# EAGLE schematic lisa_l (EAGLE 6.1)

## Sheet 1 of 6
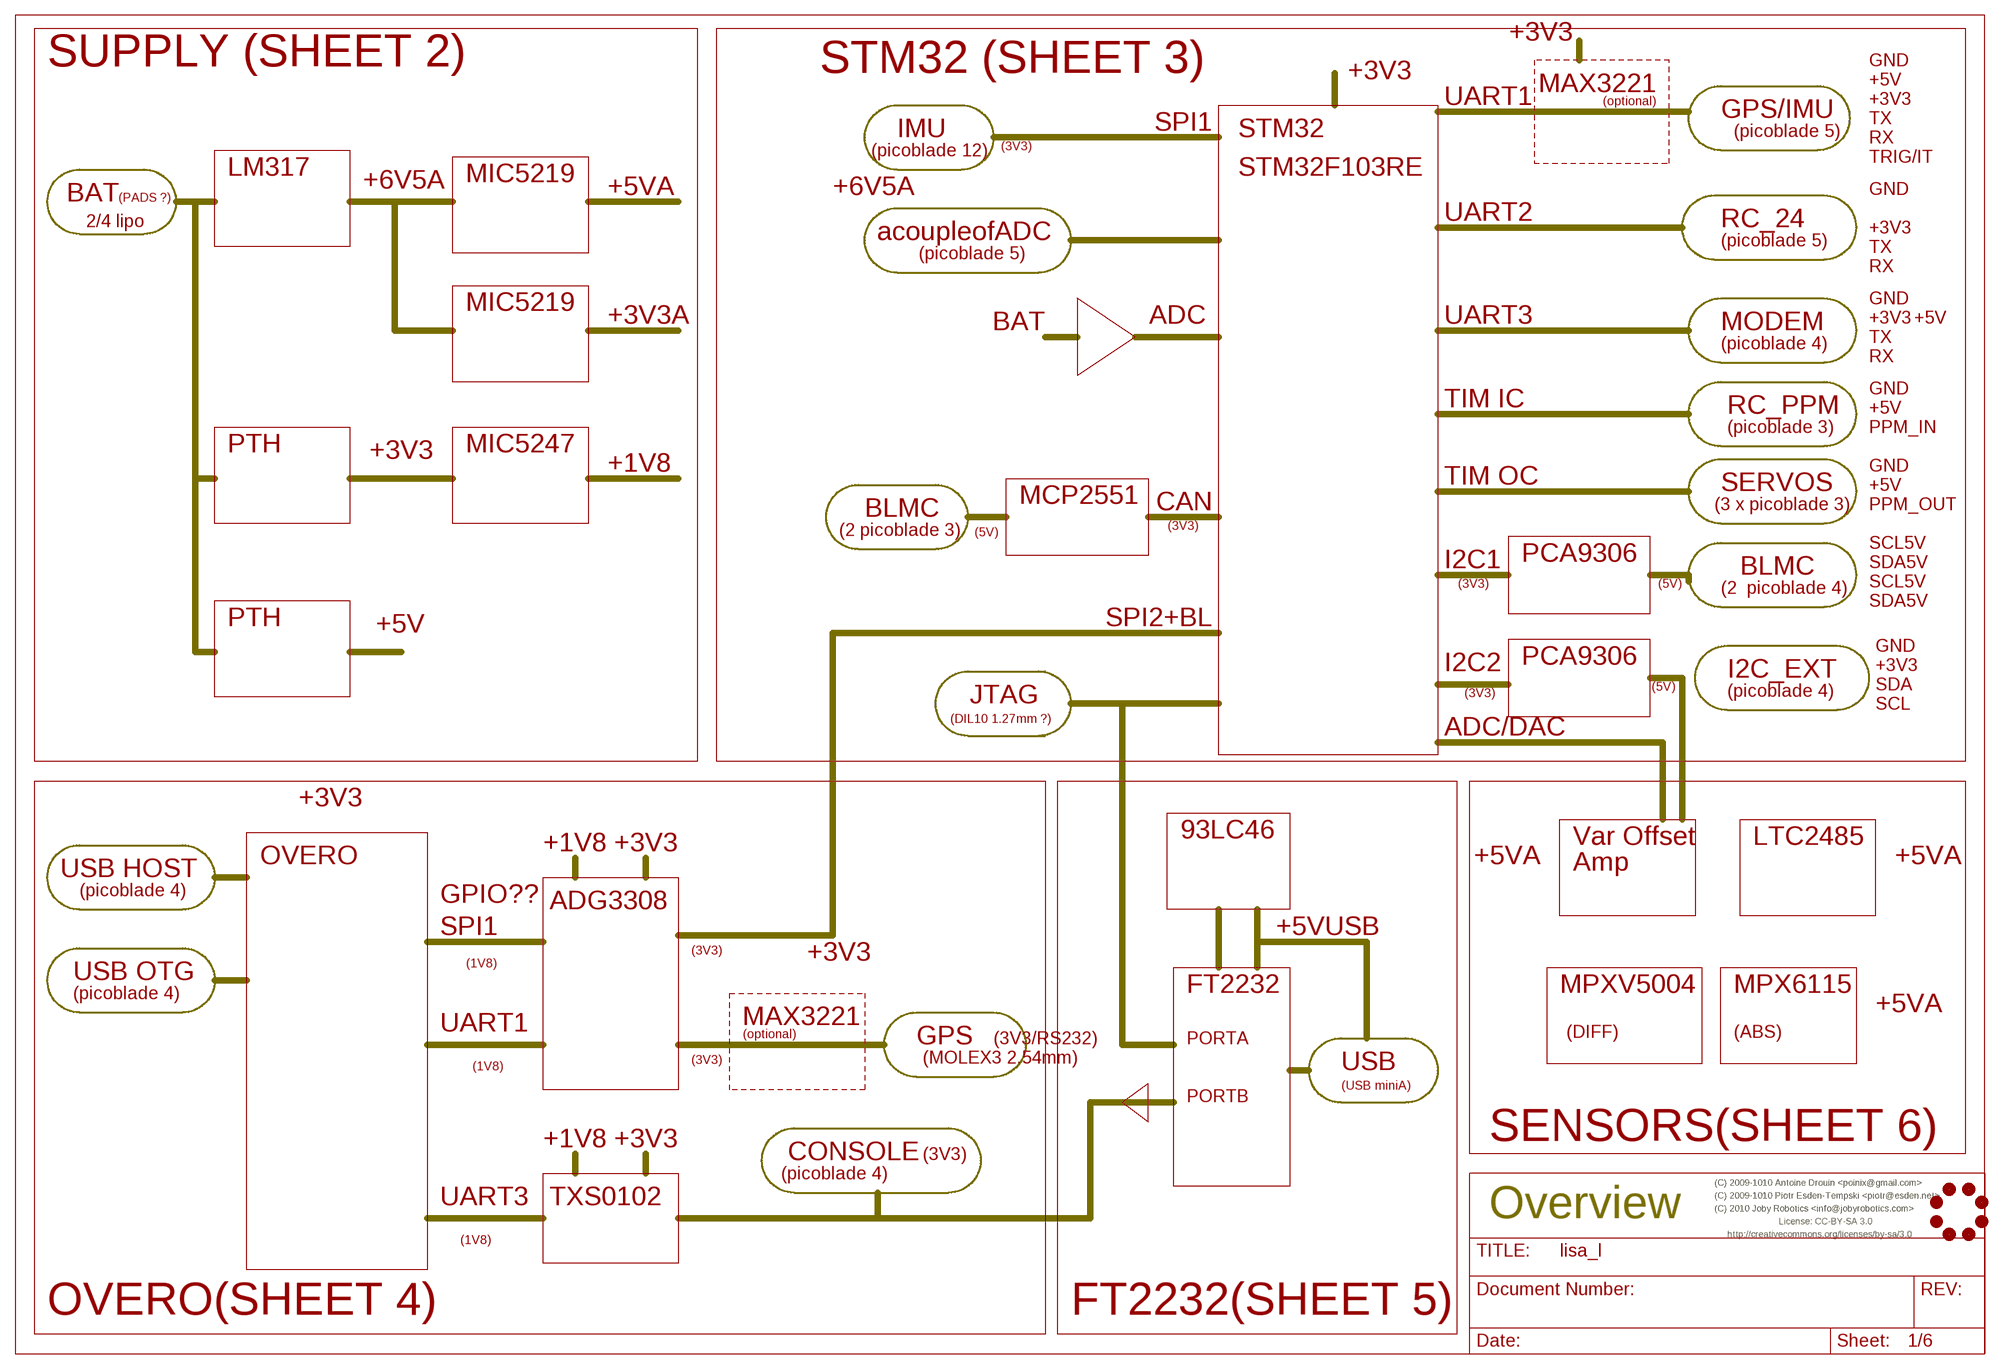
[diagram p0: schematic, sheet 1]

### Parts
JL1  JOBY_LOGO-12MIL  [JOBY_LOGO_12MIL]

### Notes on the sheet
- +3V3
- SUPPLY (SHEET 2) | STM32 (SHEET 3) | GND
- +3V3
- +5V
- MAX3221
- UART1 | (optional) | +3V3
- GPS/IMU
- TX
- IMU | SPI1 | STM32
- (picoblade 5)
- RX
- (3V3)
- (picoblade 12)
- TRIG/IT
- LM317 | MIC5219 | STM32F103RE
- +6V5A | +5VA | +6V5A
- GND
- BAT | (PADS ?)
- UART2
- 2/4 lipo | RC_24
- +3V3
- acoupleofADC
- (picoblade 5)
- TX
- (picoblade 5)
- RX
- GND
- MIC5219
- +3V3A | BAT | ADC | UART3 | MODEM | +3V3 | +5V
- TX
- (picoblade 4)
- RX
- GND
- TIM IC | RC_PPM
- +5V
- (picoblade 3) | PPM_IN
- PTH | +3V3 | MIC5247
- +1V8 | GND
- TIM OC | SERVOS
- +5V
- MCP2551 | CAN
- (3 x picoblade 3) | PPM_OUT
- BLMC
- (3V3)
- (2 picoblade 3) | (5V)
- SCL5V
- I2C1 | PCA9306
- SDA5V
- BLMC
- (3V3) | (5V) | SCL5V
- (2  picoblade 4)
- SDA5V
- PTH | +5V | SPI2+BL
- GND
- I2C2 | PCA9306
- +3V3
- I2C_EXT
- (5V) | SDA
- (3V3) | (picoblade 4)
- JTAG
- SCL
- (DIL10 1.27mm ?)
- ADC/DAC
- +3V3
- 93LC46 | Var Offset | LTC2485
- +1V8 | +3V3
- OVERO | +5VA | Amp | +5VA
- USB HOST
- (picoblade 4)
- GPIO?? | ADG3308
- SPI1 | +5VUSB
- (3V3)
- +3V3
- (1V8)
- USB OTG
- FT2232 | MPXV5004 | MPX6115
- (picoblade 4)
- +5VA
- UART1 | MAX3221
- (optional) | (DIFF) | (ABS)
- GPS | (3V3/RS232) | PORTA
- (3V3) | (MOLEX3 2.54mm)
- (1V8) | USB
- (USB miniA)
- PORTB
- +1V8 | +3V3 | SENSORS(SHEET 6)
- CONSOLE | (3V3)
- (picoblade 4)
- (C) 2009-1010 Antoine Drouin <poinix@gmail.com>
- (C) 2009-1010 Piotr Esden-Tempski <piotr@esden.net>
- UART3 | TXS0102
- (C) 2010 Joby Robotics <info@jobyrobotics.com>
- Overview
- License: CC-BY-SA 3.0
- http://creativecommons.org/licenses/by-sa/3.0
- (1V8)
- OVERO(SHEET 4) | FT2232(SHEET 5)

## Sheet 2 of 6
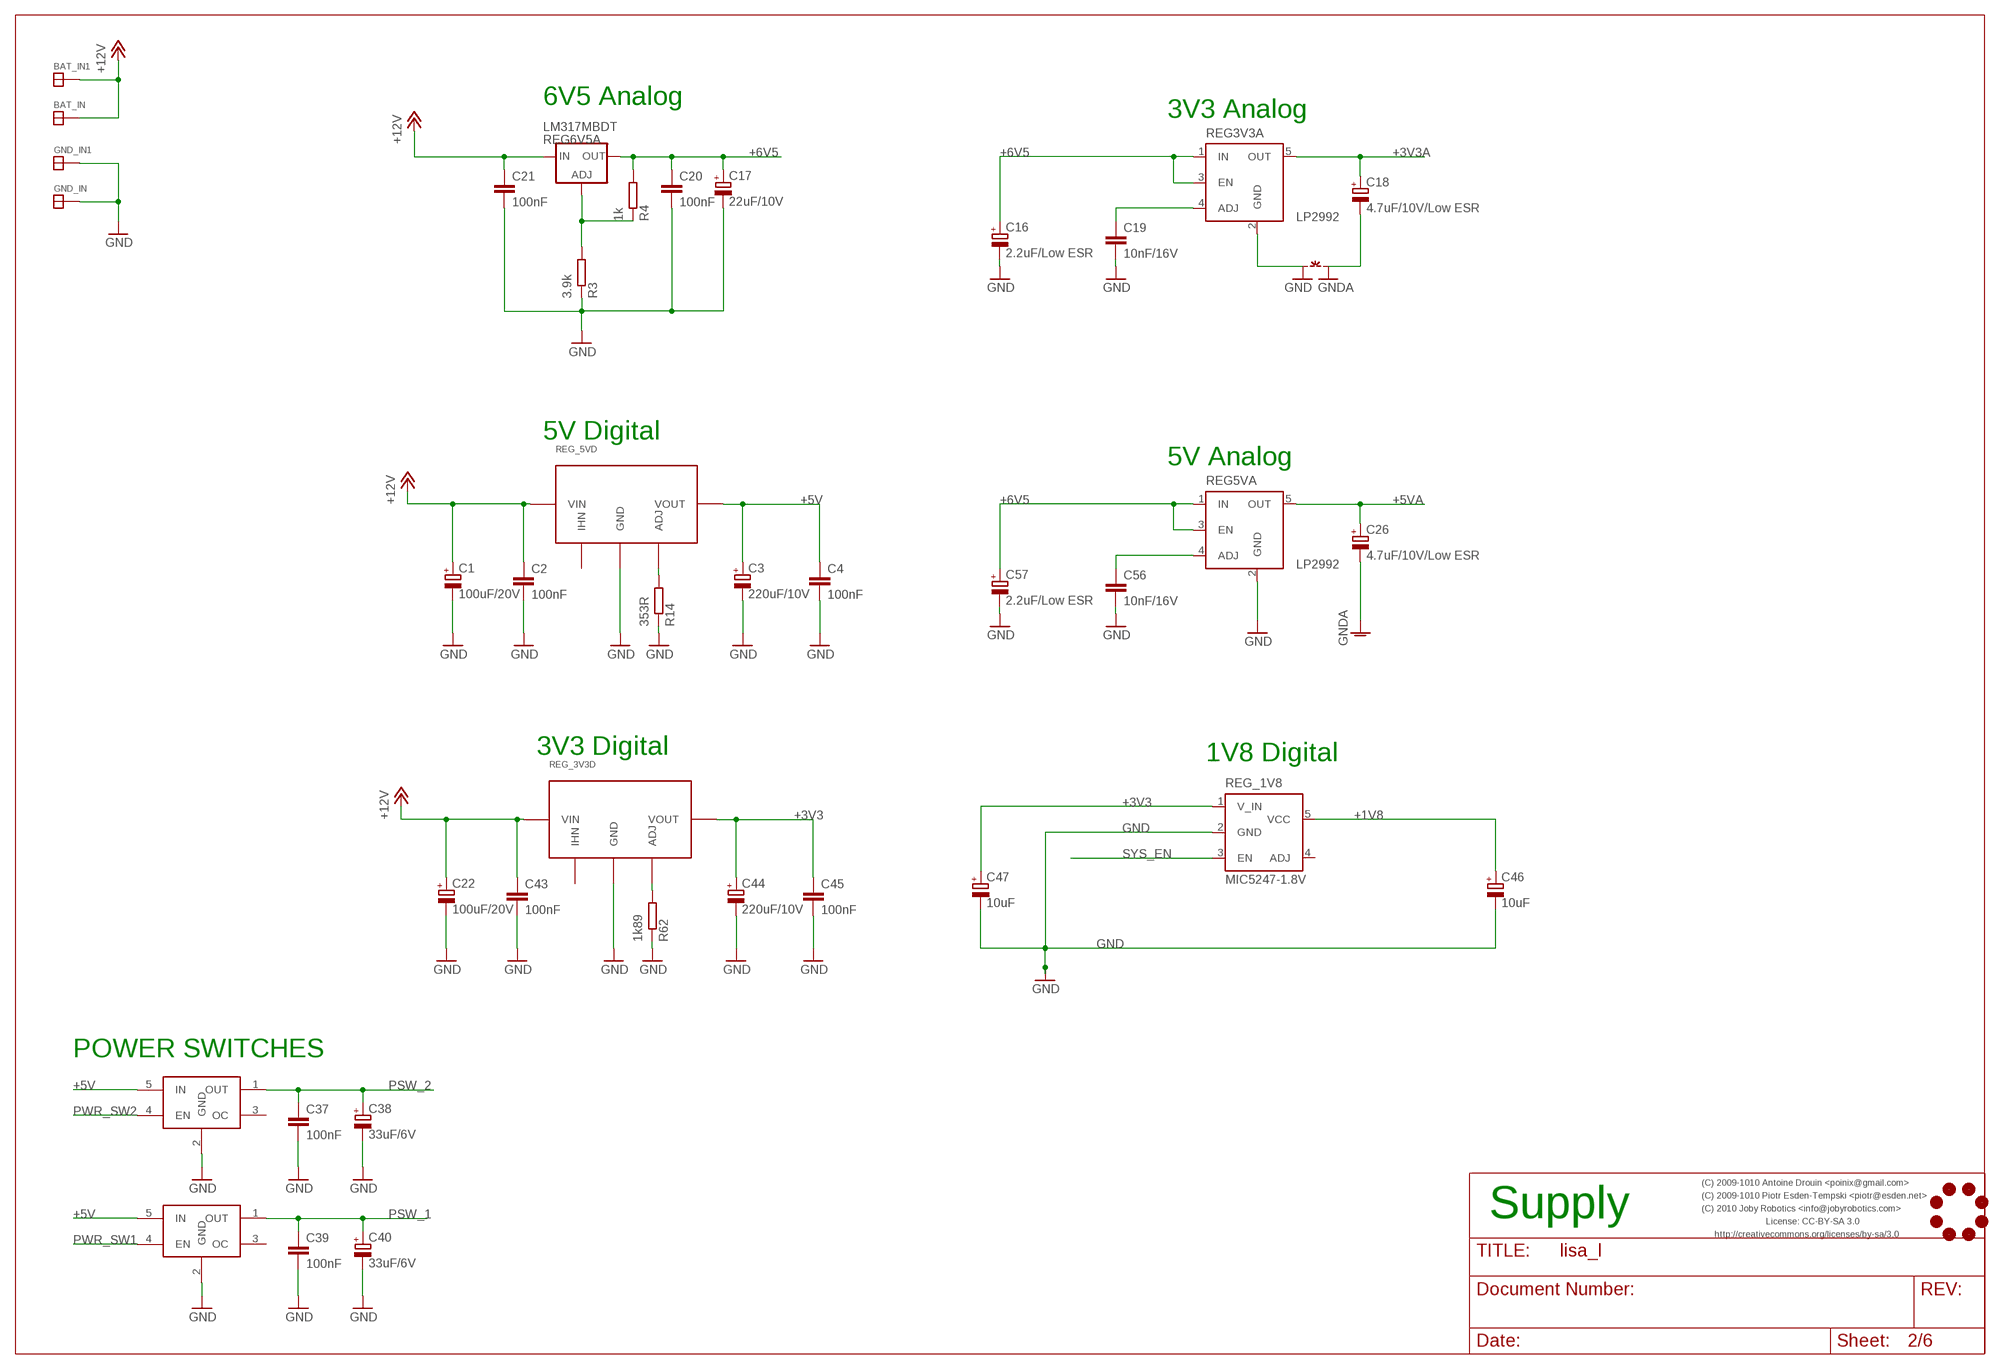
[diagram p1: schematic, sheet 2]

### Parts
BAT_IN  SOLDER_PAD150_75  [SOLD_PAD_150_75]
BAT_IN1  SOLDER_PAD150_75  [SOLD_PAD_150_75]
C1  100uF/20V  CAPACITOR-POLD  [7343/D]
C2  100nF  CAPACITOR-0603  [0603-CAP]
C3  220uF/10V  CAPACITOR-POLD  [7343/D]
C4  100nF  CAPACITOR-0603  [0603-CAP]
C16  2.2uF/Low ESR  CAPACITOR-POL-0603  [0603-POL-CAP]
C17  22uF/10V  CAPACITOR-POL-1206  [1206-POL-CAP]
C18  4.7uF/10V/Low ESR  CAPACITOR-POL-0603  [0603-POL-CAP]
C19  10nF/16V  CAPACITOR-0603  [0603-CAP]
C20  100nF  CAPACITOR-0603  [0603-CAP]
C21  100nF  CAPACITOR-0603  [0603-CAP]
C22  100uF/20V  CAPACITOR-POLD  [7343/D]
C26  4.7uF/10V/Low ESR  CAPACITOR-POL-0603  [0603-POL-CAP]
C37  100nF  CAPACITOR-0603  [0603-CAP]
C38  33uF/6V  CAPACITOR-POL-1206  [1206-POL-CAP]
C39  100nF  CAPACITOR-0603  [0603-CAP]
C40  33uF/6V  CAPACITOR-POL-1206  [1206-POL-CAP]
C43  100nF  CAPACITOR-0603  [0603-CAP]
C44  220uF/10V  CAPACITOR-POLD  [7343/D]
C45  100nF  CAPACITOR-0603  [0603-CAP]
C46  10uF  CAPACITOR-POL-0603  [0603-POL-CAP]
C47  10uF  CAPACITOR-POL-0603  [0603-POL-CAP]
C56  10nF/16V  CAPACITOR-0603  [0603-CAP]
C57  2.2uF/Low ESR  CAPACITOR-POL-0603  [0603-POL-CAP]
GND_IN  SOLDER_PAD150_75  [SOLD_PAD_150_75]
GND_IN1  SOLDER_PAD150_75  [SOLD_PAD_150_75]
JL2  JOBY_LOGO-12MIL  [JOBY_LOGO_12MIL]
PWS1  TPS2051B  [SOT23-5L]
PWS2  TPS2051B  [SOT23-5L]
R3  3.9k  RESISTOR-0603  [0603-RES]
R4  1k  RESISTOR-0603  [0603-RES]
R14  353R  RESISTOR-0603  [0603-RES]
R62  1k89  RESISTOR-0603  [0603-RES]
REG3V3A  LP2992  MIC5219BM5  [SOT23-5]
REG5VA  LP2992  MIC5219BM5  [SOT23-5]
REG6V5A  LM317MBDT  [DPACK]
REG_1V8  MIC5247-1.8V  MIC5219YM5  [SOT-23-5]
REG_3V3D  PTHTH  [PTH_TH]
REG_5VD  PTHTH  [PTH_TH]
~NUDEV~1  GND-GNDA  [GND-GNDA]

### Nets
+1V8 [supply]: C46.+ REG_1V8.5(VCC) ; also sheet 4
+3V3: C44.+ C45.P$1 C47.+ REG_1V8.1(V_IN) REG_3V3D.P$3(VOUT) ; also sheet 3,4
+3V3A: C18.+ REG3V3A.5(OUT) ; also sheet 6
+5V: C3.+ C4.P$1 PWS1.5(IN) PWS2.5(IN) REG_5VD.P$3(VOUT) ; also sheet 3,4
+5VA: C26.+ REG5VA.5(OUT) ; also sheet 6
+6V5: C16.+ C17.+ C20.P$1 C57.+ R4.P$2 REG3V3A.1(IN) REG3V3A.3(EN) REG5VA.1(IN) REG5VA.3(EN) REG6V5A.4(OUT) ; also sheet 3,4
+12V: BAT_IN1.P$1 BAT_IN.P$1 C1.+ C2.P$1 C21.P$1 C22.+ C43.P$1 REG6V5A.3(IN) REG_3V3D.P$1(VIN) REG_5VD.P$1(VIN) ; also sheet 3
GND: C1.- C2.P$2 C3.- C4.P$2 C16.- C17.- C19.P$2 C20.P$2 C21.P$2 C22.- C37.P$2 C38.- C39.P$2 C40.- C43.P$2 C44.- C45.P$2 C46.- C47.- C56.P$2 C57.- GND_IN1.P$1 GND_IN.P$1 PWS1.2(GND) PWS2.2(GND) R3.P$1 R14.P$1 R62.P$1 REG3V3A.2(GND) REG5VA.2(GND) REG_1V8.2(GND) REG_3V3D.P$2(GND) REG_5VD.P$2(GND) ~NUDEV~1.GND ; also sheet 3,4,5
GNDA: C18.- C26.- ~NUDEV~1.GNDA ; also sheet 6
N$3: R62.P$2 REG_3V3D.P$4(ADJ)
N$10: C56.P$1 REG5VA.4(ADJ)
N$23: C19.P$1 REG3V3A.4(ADJ)
N$33: R3.P$2 R4.P$1 REG6V5A.1(ADJ)
PSW_1: C39.P$1 C40.+ PWS1.1(OUT) ; also sheet 3
PSW_2: C37.P$1 C38.+ PWS2.1(OUT) ; also sheet 3
PWR_SW1: PWS1.4(EN) ; also sheet 3
PWR_SW2: PWS2.4(EN) ; also sheet 3
RIPRIP: R14.P$2 REG_5VD.P$4(ADJ)
SYS_EN: REG_1V8.3(EN) ; also sheet 4
Unconnected: PWS1.3(OC) PWS2.3(OC) REG_1V8.4(ADJ) REG_3V3D.P$5(IHN) REG_5VD.P$5(IHN)

### Notes on the sheet
- 6V5 Analog
- 3V3 Analog
- 5V Digital
- 5V Analog
- 3V3 Digital | 1V8 Digital
- POWER SWITCHES
- (C) 2009-1010 Antoine Drouin <poinix@gmail.com>
- (C) 2009-1010 Piotr Esden-Tempski <piotr@esden.net>
- (C) 2010 Joby Robotics <info@jobyrobotics.com>
- Supply
- License: CC-BY-SA 3.0
- http://creativecommons.org/licenses/by-sa/3.0

## Sheet 3 of 6
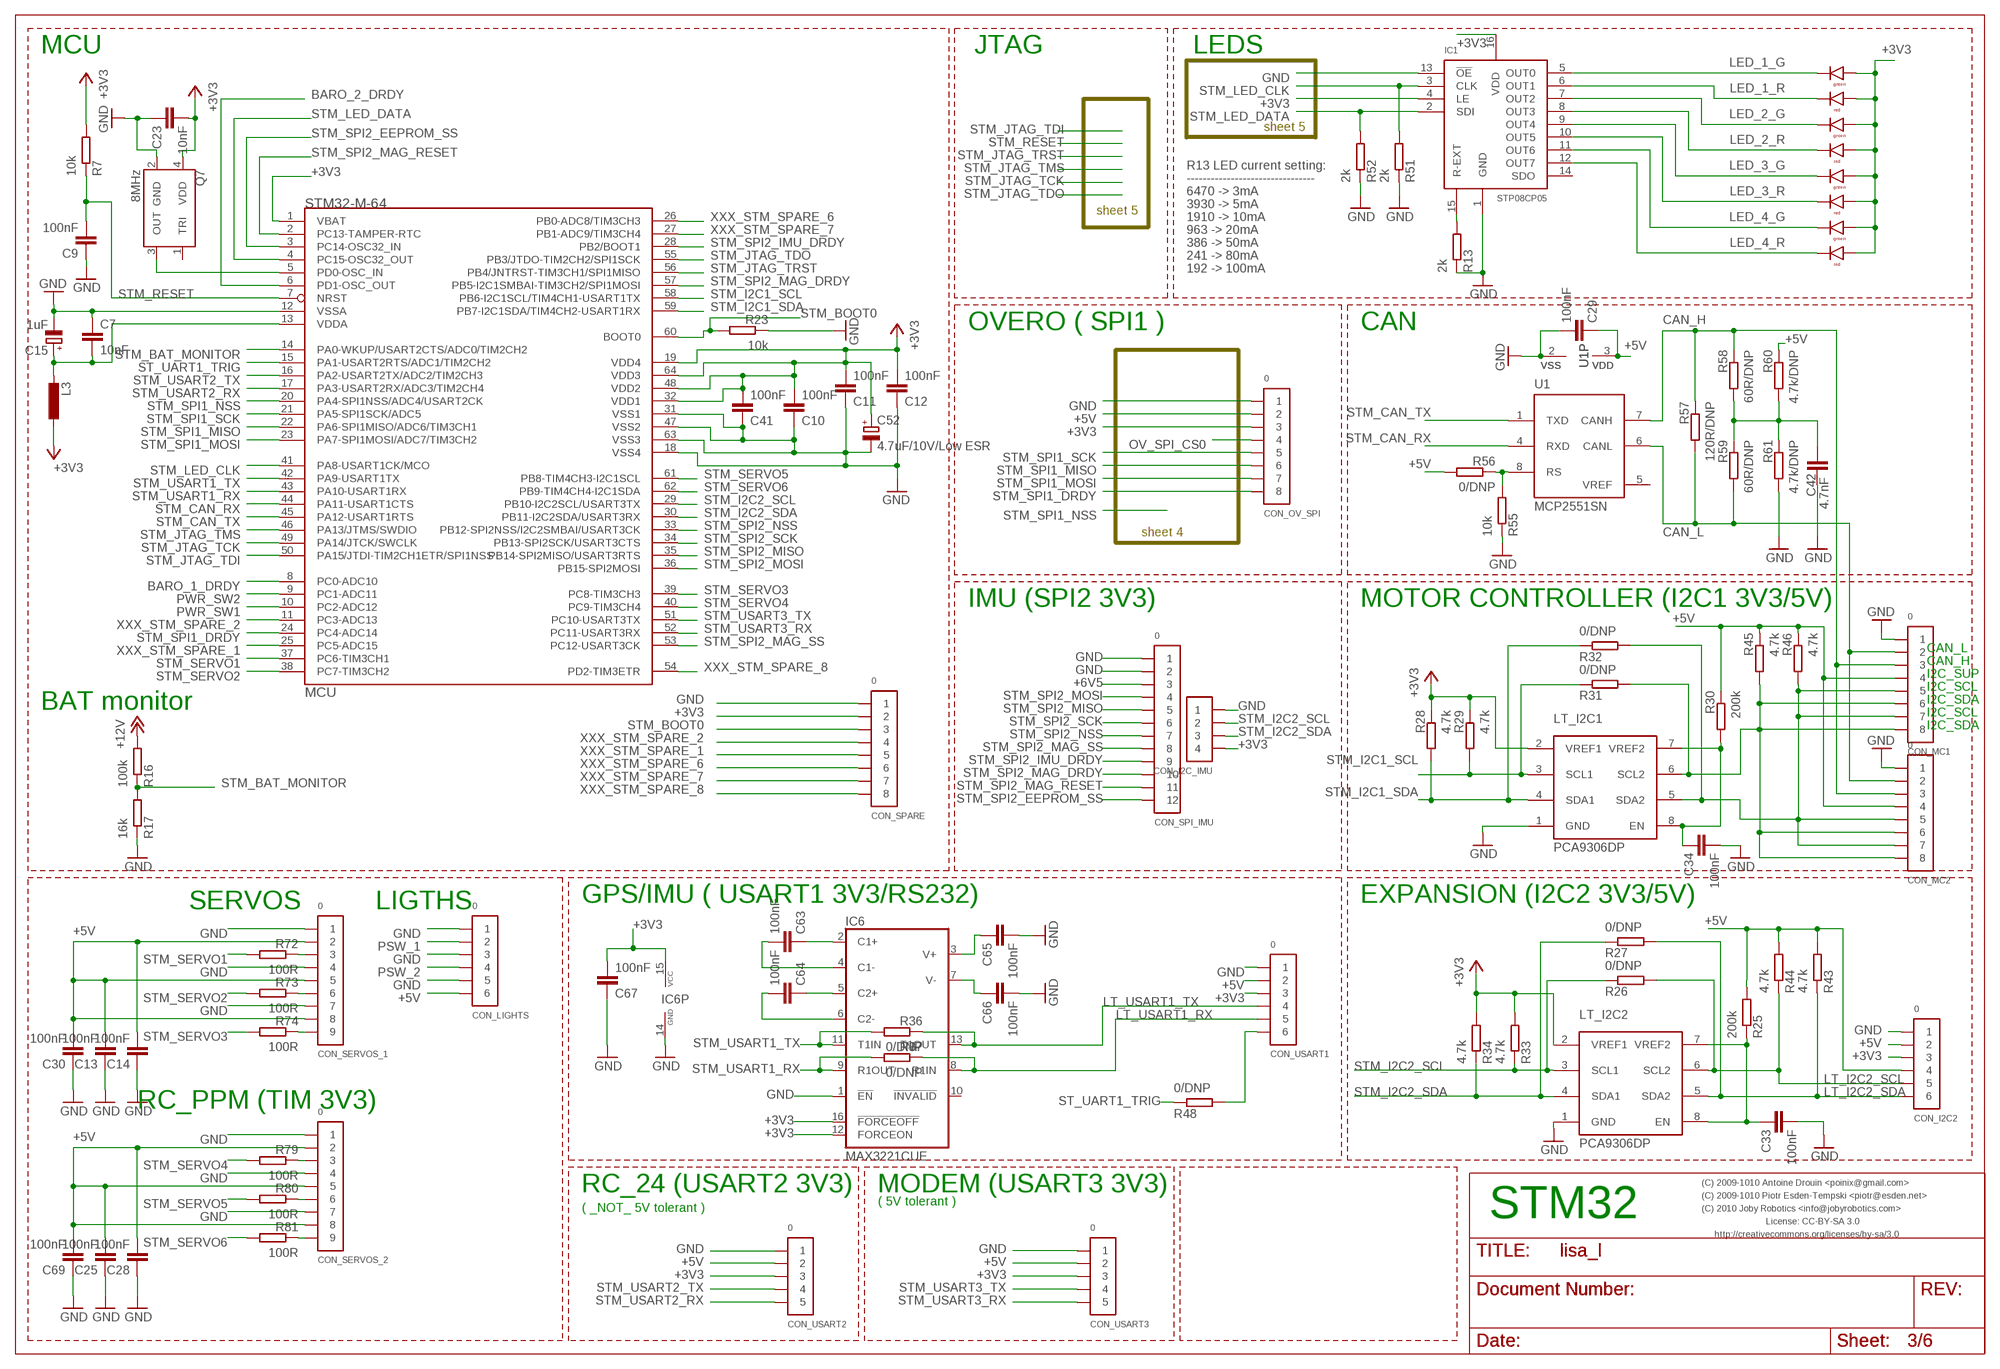
[diagram p2: schematic, sheet 3]

### Parts
C7  10nF  CAPACITOR-0603  [0603-CAP]
C9  100nF  CAPACITOR-0603  [0603-CAP]
C10  100nF  CAPACITOR-0603  [0603-CAP]
C11  100nF  CAPACITOR-0603  [0603-CAP]
C12  100nF  CAPACITOR-0603  [0603-CAP]
C13  100nF  CAPACITOR-0603  [0603-CAP]
C14  100nF  CAPACITOR-0603  [0603-CAP]
C15  1uF  CAPACITOR-POL-0603  [0603-POL-CAP]
C23  10nF  CAPACITOR-0603  [0603-CAP]
C25  100nF  CAPACITOR-0603  [0603-CAP]
C28  100nF  CAPACITOR-0603  [0603-CAP]
C29  100nF  CAPACITOR-0603  [0603-CAP]
C30  100nF  CAPACITOR-0603  [0603-CAP]
C33  100nF  CAPACITOR-0603  [0603-CAP]
C34  100nF  CAPACITOR-0603  [0603-CAP]
C41  100nF  CAPACITOR-0603  [0603-CAP]
C42  4.7nF  CAPACITOR-0603  [0603-CAP]
C52  4.7uF/10V/Low ESR  CAPACITOR-POL-0603  [0603-POL-CAP]
C63  100nF  CAPACITOR-0603  [0603-CAP]
C64  100nF  CAPACITOR-0603  [0603-CAP]
C65  100nF  CAPACITOR-0603  [0603-CAP]
C66  100nF  CAPACITOR-0603  [0603-CAP]
C67  100nF  CAPACITOR-0603  [0603-CAP]
C69  100nF  CAPACITOR-0603  [0603-CAP]
CON_I2C2  0  CONN_6-1-53261  [PB-53261-06]
CON_I2C_IMU  CONN_4-1-53398  [PB-53398-04]
CON_LIGHTS  0  CONN_6-1-53261  [PB-53261-06]
CON_MC1  0  CONN_8-1-53261  [PB-53261-08]
CON_MC2  0  CONN_8-1-53261  [PB-53261-08]
CON_OV_SPI  0  CONN_8-1-53398  [PB-53398-08]
CON_SERVOS_1  0  CONN_9-1-53261  [PB-53261-09]
CON_SERVOS_2  0  CONN_9-1-53261  [PB-53261-09]
CON_SPARE  0  CONN_8-1-53261  [PB-53261-08]
CON_SPI_IMU  0  CONN_12-1-53398  [PB-53398-12]
CON_USART1  0  CONN_6-1-53398  [PB-53398-06]
CON_USART2  0  CONN_5-1-53261  [PB-53261-05]
CON_USART3  0  CONN_5-1-53261  [PB-53261-05]
IC1  STP08CP05  [TSSOP16]
IC6  MAX3221CUE  [TSSOP16]
L3  INDUCTOR-0603  [0603-IND]
LED_1  LED_DUO  [DUO_LED]
LED_2  LED_DUO  [DUO_LED]
LED_3  LED_DUO  [DUO_LED]
LED_4  LED_DUO  [DUO_LED]
LT_I2C1  PCA9306DP  [TSSOP_B3]
LT_I2C2  PCA9306DP  [TSSOP_B3]
MCU  STM32-M-64  [LQFP64]
Q7  8MHz  ASE_ASCILLATOR  [ASE_OSCILLATOR]
R7  10k  RESISTOR-0603  [0603-RES]
R13  2k  RESISTOR-0603  [0603-RES]
R16  100k  RESISTOR-0603  [0603-RES]
R17  16k  RESISTOR-0603  [0603-RES]
R23  10k  RESISTOR-0603  [0603-RES]
R25  200k  RESISTOR-0603  [0603-RES]
R26  0/DNP  RESISTOR-0603  [0603-RES]
R27  0/DNP  RESISTOR-0603  [0603-RES]
R28  4.7k  RESISTOR-0603  [0603-RES]
R29  4.7k  RESISTOR-0603  [0603-RES]
R30  200k  RESISTOR-0603  [0603-RES]
R31  0/DNP  RESISTOR-0603  [0603-RES]
R32  0/DNP  RESISTOR-0603  [0603-RES]
R33  4.7k  RESISTOR-0603  [0603-RES]
R34  4.7k  RESISTOR-0603  [0603-RES]
R36  0/DNP  RESISTOR-0603  [0603-RES]
R37  0/DNP  RESISTOR-0603  [0603-RES]
R43  4.7k  RESISTOR-0603  [0603-RES]
R44  4.7k  RESISTOR-0603  [0603-RES]
R45  4.7k  RESISTOR-0603  [0603-RES]
R46  4.7k  RESISTOR-0603  [0603-RES]
R48  0/DNP  RESISTOR-0603  [0603-RES]
R51  2k  RESISTOR-0603  [0603-RES]
R52  2k  RESISTOR-0603  [0603-RES]
R55  10k  RESISTOR-0603  [0603-RES]
R56  0/DNP  RESISTOR-0603  [0603-RES]
R57  120R/DNP  RESISTOR-0603  [0603-RES]
R58  60R/DNP  RESISTOR-0603  [0603-RES]
R59  60R/DNP  RESISTOR-0603  [0603-RES]
R60  4.7k/DNP  RESISTOR-0603  [0603-RES]
R61  4.7k/DNP  RESISTOR-0603  [0603-RES]
R72  100R  RESISTOR-0603  [0603-RES]
R73  100R  RESISTOR-0603  [0603-RES]
R74  100R  RESISTOR-0603  [0603-RES]
R79  100R  RESISTOR-0603  [0603-RES]
R80  100R  RESISTOR-0603  [0603-RES]
R81  100R  RESISTOR-0603  [0603-RES]
U1  MCP2551SN  [SO-08]

### Nets
+3V3: C10.P$2 C11.P$2 C12.P$2 C23.P$2 C41.P$2 C52.+ C67.P$2 CON_I2C2.3 CON_I2C_IMU.4 CON_OV_SPI.3 CON_SPARE.2 CON_USART1.3 CON_USART2.3 CON_USART3.3 IC1.4(LE) IC1.16(VDD) IC6.12(FORCEON) IC6.15(VCC) IC6.16(!FORCEOFF) L3.P$1 LED_1.1 LED_1.4 LED_2.1 LED_2.4 LED_3.1 LED_3.4 LED_4.1 LED_4.4 LT_I2C1.2(VREF1) LT_I2C2.2(VREF1) MCU.1(VBAT) MCU.19(VDD4) MCU.32(VDD1) MCU.48(VDD2) MCU.64(VDD3) Q7.4(VDD) R7.P$2 R28.P$1 R29.P$1 R33.P$2 R34.P$2 ; also sheet 2,4
+5V: C13.P$2 C14.P$2 C25.P$2 C28.P$2 C29.P$1 C30.P$2 C69.P$2 CON_I2C2.2 CON_I2C2.4 CON_LIGHTS.6 CON_MC1.4 CON_MC2.4 CON_OV_SPI.2 CON_SERVOS_1.2 CON_SERVOS_1.5 CON_SERVOS_1.8 CON_SERVOS_2.2 CON_SERVOS_2.5 CON_SERVOS_2.8 CON_USART1.2 CON_USART2.2 CON_USART3.2 R25.P$2 R30.P$1 R43.P$2 R44.P$2 R45.P$1 R46.P$1 R56.P$2 R60.P$1 U1.3(VDD) ; also sheet 2,4
+6V5: CON_SPI_IMU.3 ; also sheet 2,4
+12V: R16.P$2 ; also sheet 2
BARO_1_DRDY: MCU.8(PC0-ADC10) ; also sheet 6
BARO_2_DRDY: MCU.6(PD1-OSC_OUT) ; also sheet 6
CAN_H: CON_MC1.3 CON_MC2.3 R57.P$1 R58.P$1 U1.7(CANH)
CAN_L: CON_MC1.2 CON_MC2.2 R57.P$2 R59.P$2 U1.6(CANL)
GND: C7.P$1 C9.P$1 C10.P$1 C11.P$1 C12.P$1 C13.P$1 C14.P$1 C15.- C23.P$1 C25.P$1 C28.P$1 C29.P$2 C30.P$1 C33.P$2 C34.P$2 C41.P$1 C42.P$1 C52.- C65.P$2 C66.P$2 C67.P$1 C69.P$1 CON_I2C2.1 CON_I2C_IMU.1 CON_LIGHTS.1 CON_LIGHTS.3 CON_LIGHTS.5 CON_MC1.1 CON_MC2.1 CON_OV_SPI.1 CON_SERVOS_1.1 CON_SERVOS_1.4 CON_SERVOS_1.7 CON_SERVOS_2.1 CON_SERVOS_2.4 CON_SERVOS_2.7 CON_SPARE.1 CON_SPI_IMU.1 CON_SPI_IMU.2 CON_USART1.1 CON_USART2.1 CON_USART3.1 IC1.1(GND) IC1.13(!OE) IC6.1(!EN) IC6.14(GND) LT_I2C1.1(GND) LT_I2C2.1(GND) MCU.12(VSSA) MCU.18(VSS4) MCU.31(VSS1) MCU.47(VSS2) MCU.63(VSS3) Q7.2(GND) R13.P$1 R17.P$1 R23.P$1 R51.P$1 R52.P$1 R55.P$1 R61.P$2 U1.2(VSS) ; also sheet 2,4,5
INT/TRIGGER: CON_USART1.6 R48.P$2
LED_1_G: IC1.5(OUT0) LED_1.3
LED_1_R: IC1.6(OUT1) LED_1.2
LED_2_G: IC1.7(OUT2) LED_2.3
LED_2_R: IC1.8(OUT3) LED_2.2
LED_3_G: IC1.9(OUT4) LED_3.3
LED_3_R: IC1.10(OUT5) LED_3.2
LED_4_G: IC1.11(OUT6) LED_4.3
LED_4_R: IC1.12(OUT7) LED_4.2
LT_I2C2_SCL: CON_I2C2.5 LT_I2C2.6(SCL2) R26.P$2 R44.P$1
LT_I2C2_SDA: CON_I2C2.6 LT_I2C2.5(SDA2) R27.P$2 R43.P$1
LT_USART1_RX: CON_USART1.5 IC6.8(R1IN) R37.P$1
LT_USART1_TX: CON_USART1.4 IC6.13(T1OUT) R36.P$1
N$1: IC1.15(R-EXT) R13.P$2
N$2: MCU.5(PD0-OSC_IN) Q7.3(OUT)
N$11: C34.P$1 LT_I2C1.7(VREF2) LT_I2C1.8(EN) R30.P$2
N$17: CON_SERVOS_1.3 R72.P$1
N$19: R55.P$2 R56.P$1 U1.8(RS)
N$20: C33.P$1 LT_I2C2.7(VREF2) LT_I2C2.8(EN) R25.P$1
N$25: C42.P$2 R58.P$2 R59.P$1 R60.P$2 R61.P$1
N$37: CON_SERVOS_1.6 R73.P$1
N$38: CON_SERVOS_1.9 R74.P$1
N$57: CON_SERVOS_2.9 R81.P$1
N$58: CON_SERVOS_2.6 R80.P$1
N$59: CON_SERVOS_2.3 R79.P$1
N$127: C63.P$1 IC6.2(C1+)
N$130: C63.P$2 IC6.4(C1-)
N$131: C64.P$1 IC6.5(C2+)
N$132: C64.P$2 IC6.6(C2-)
N$133: C66.P$1 IC6.7(V-)
N$134: C65.P$1 IC6.3(V+)
OV_SPI_CS0: CON_OV_SPI.4 ; also sheet 4
PSW_1: CON_LIGHTS.2 ; also sheet 2
PSW_2: CON_LIGHTS.4 ; also sheet 2
PWR_SW1: MCU.10(PC2-ADC12) ; also sheet 2
PWR_SW2: MCU.9(PC1-ADC11) ; also sheet 2
SCL_0_TRANSLATED: CON_MC1.6 CON_MC1.8 CON_MC2.6 CON_MC2.8 LT_I2C1.6(SCL2) R31.P$2 R45.P$2
SDA_0_TRANSLATED: CON_MC1.5 CON_MC1.7 CON_MC2.5 CON_MC2.7 LT_I2C1.5(SDA2) R32.P$2 R46.P$2
ST_UART1_TRIG: MCU.15(PA1-USART2RTS/ADC1/TIM2CH2) R48.P$1
STM_BAT_MONITOR: MCU.14(PA0-WKUP/USART2CTS/ADC0/TIM2CH2) R16.P$1 R17.P$2
STM_BOOT0: CON_SPARE.3 MCU.60(BOOT0) R23.P$2
STM_CAN_RX: MCU.44(PA11-USART1CTS) U1.4(RXD)
STM_CAN_TX: MCU.45(PA12-USART1RTS) U1.1(TXD)
STM_I2C1_SCL: LT_I2C1.3(SCL1) MCU.58(PB6-I2C1SCL/TIM4CH1-USART1TX) R29.P$2 R31.P$1
STM_I2C1_SDA: LT_I2C1.4(SDA1) MCU.59(PB7-I2C1SDA/TIM4CH2-USART1RX) R28.P$2 R32.P$1
STM_I2C2_SCL: CON_I2C_IMU.2 LT_I2C2.3(SCL1) MCU.29(PB10-I2C2SCL/USART3TX) R26.P$1 R33.P$1 ; also sheet 6
STM_I2C2_SDA: CON_I2C_IMU.3 LT_I2C2.4(SDA1) MCU.30(PB11-I2C2SDA/USART3RX) R27.P$1 R34.P$1 ; also sheet 6
STM_JTAG_TCK: MCU.49(PA14/JTCK/SWCLK) ; also sheet 5
STM_JTAG_TDI: MCU.50(PA15/JTDI-TIM2CH1ETR/SPI1NSS) ; also sheet 5
STM_JTAG_TDO: MCU.55(PB3/JTDO-TIM2CH2/SPI1SCK) ; also sheet 5
STM_JTAG_TMS: MCU.46(PA13/JTMS/SWDIO) ; also sheet 5
STM_JTAG_TRST: MCU.56(PB4/JNTRST-TIM3CH1/SPI1MISO) ; also sheet 5
STM_LED_CLK: IC1.3(CLK) MCU.41(PA8-USART1CK/MCO) R51.P$2
STM_LED_DATA: IC1.2(SDI) MCU.4(PC15-OSC32_OUT) R52.P$2
STM_RESET: C9.P$2 MCU.7(NRST) R7.P$1 ; also sheet 5
STM_SERVO1: MCU.37(PC6-TIM3CH1) R72.P$2
STM_SERVO2: MCU.38(PC7-TIM3CH2) R73.P$2
STM_SERVO3: MCU.39(PC8-TIM3CH3) R74.P$2
STM_SERVO4: MCU.40(PC9-TIM3CH4) R79.P$2
STM_SERVO5: MCU.61(PB8-TIM4CH3-I2C1SCL) R80.P$2
STM_SERVO6: MCU.62(PB9-TIM4CH4-I2C1SDA) R81.P$2
STM_SPI1_DRDY: CON_OV_SPI.8 MCU.24(PC4-ADC14) ; also sheet 4
STM_SPI1_MISO: CON_OV_SPI.6 MCU.22(PA6-SPI1MISO/ADC6/TIM3CH1) ; also sheet 4
STM_SPI1_MOSI: CON_OV_SPI.7 MCU.23(PA7-SPI1MOSI/ADC7/TIM3CH2) ; also sheet 4
STM_SPI1_NSS: MCU.20(PA4-SPI1NSS/ADC4/USART2CK) ; also sheet 4
STM_SPI1_SCK: CON_OV_SPI.5 MCU.21(PA5-SPI1SCK/ADC5) ; also sheet 4
STM_SPI2_EEPROM_SS: CON_SPI_IMU.12 MCU.3(PC14-OSC32_IN)
STM_SPI2_IMU_DRDY: CON_SPI_IMU.9 MCU.28(PB2/BOOT1)
STM_SPI2_MAG_DRDY: CON_SPI_IMU.10 MCU.57(PB5-I2C1SMBAI-TIM3CH2/SPI1MOSI)
STM_SPI2_MAG_RESET: CON_SPI_IMU.11 MCU.2(PC13-TAMPER-RTC)
STM_SPI2_MAG_SS: CON_SPI_IMU.8 MCU.53(PC12-USART3CK)
STM_SPI2_MISO: CON_SPI_IMU.5 MCU.35(PB14-SPI2MISO/USART3RTS)
STM_SPI2_MOSI: CON_SPI_IMU.4 MCU.36(PB15-SPI2MOSI)
STM_SPI2_NSS: CON_SPI_IMU.7 MCU.33(PB12-SPI2NSS/I2C2SMBAI/USART3CK)
STM_SPI2_SCK: CON_SPI_IMU.6 MCU.34(PB13-SPI2SCK/USART3CTS)
STM_USART1_RX: IC6.9(R1OUT) MCU.43(PA10-USART1RX) R37.P$2
STM_USART1_TX: IC6.11(T1IN) MCU.42(PA9-USART1TX) R36.P$2
STM_USART2_RX: CON_USART2.5 MCU.17(PA3-USART2RX/ADC3/TIM2CH4)
STM_USART2_TX: CON_USART2.4 MCU.16(PA2-USART2TX/ADC2/TIM2CH3)
STM_USART3_RX: CON_USART3.5 MCU.52(PC11-USART3RX)
STM_USART3_TX: CON_USART3.4 MCU.51(PC10-USART3TX)
VDDA: C7.P$2 C15.+ L3.P$2 MCU.13(VDDA)
XXX_STM_SPARE_1: CON_SPARE.5 MCU.25(PC5-ADC15)
XXX_STM_SPARE_2: CON_SPARE.4 MCU.11(PC3-ADC13)
XXX_STM_SPARE_6: CON_SPARE.6 MCU.26(PB0-ADC8/TIM3CH3)
XXX_STM_SPARE_7: CON_SPARE.7 MCU.27(PB1-ADC9/TIM3CH4)
XXX_STM_SPARE_8: CON_SPARE.8 MCU.54(PD2-TIM3ETR)
Unconnected: IC1.14(SDO) IC6.10(!INVALID) Q7.1(TRI)

### Notes on the sheet
- MCU | JTAG | LEDS
- sheet 5
- R13 LED current setting:
- --------------------------------
- 6470 -> 3mA
- 3930 -> 5mA
- sheet 5
- 1910 -> 10mA
- 963 -> 20mA
- 386 -> 50mA
- 241 -> 80mA
- 192 -> 100mA
- OVERO ( SPI1 ) | CAN
- sheet 4
- IMU (SPI2 3V3) | MOTOR CONTROLLER (I2C1 3V3/5V)
- CAN_L
- CAN_H
- I2C_SUP
- I2C_SCL
- I2C_SDA
- BAT monitor
- I2C_SCL
- I2C_SDA
- SERVOS | LIGTHS | GPS/IMU ( USART1 3V3/RS232) | EXPANSION (I2C2 3V3/5V)
- RC_PPM (TIM 3V3)
- (C) 2009-1010 Antoine Drouin <poinix@gmail.com>
- RC_24 (USART2 3V3) | MODEM (USART3 3V3)
- (C) 2009-1010 Piotr Esden-Tempski <piotr@esden.net>
- ( 5V tolerant )
- ( _NOT_ 5V tolerant ) | (C) 2010 Joby Robotics <info@jobyrobotics.com>
- STM32
- License: CC-BY-SA 3.0
- http://creativecommons.org/licenses/by-sa/3.0

## Sheet 4 of 6
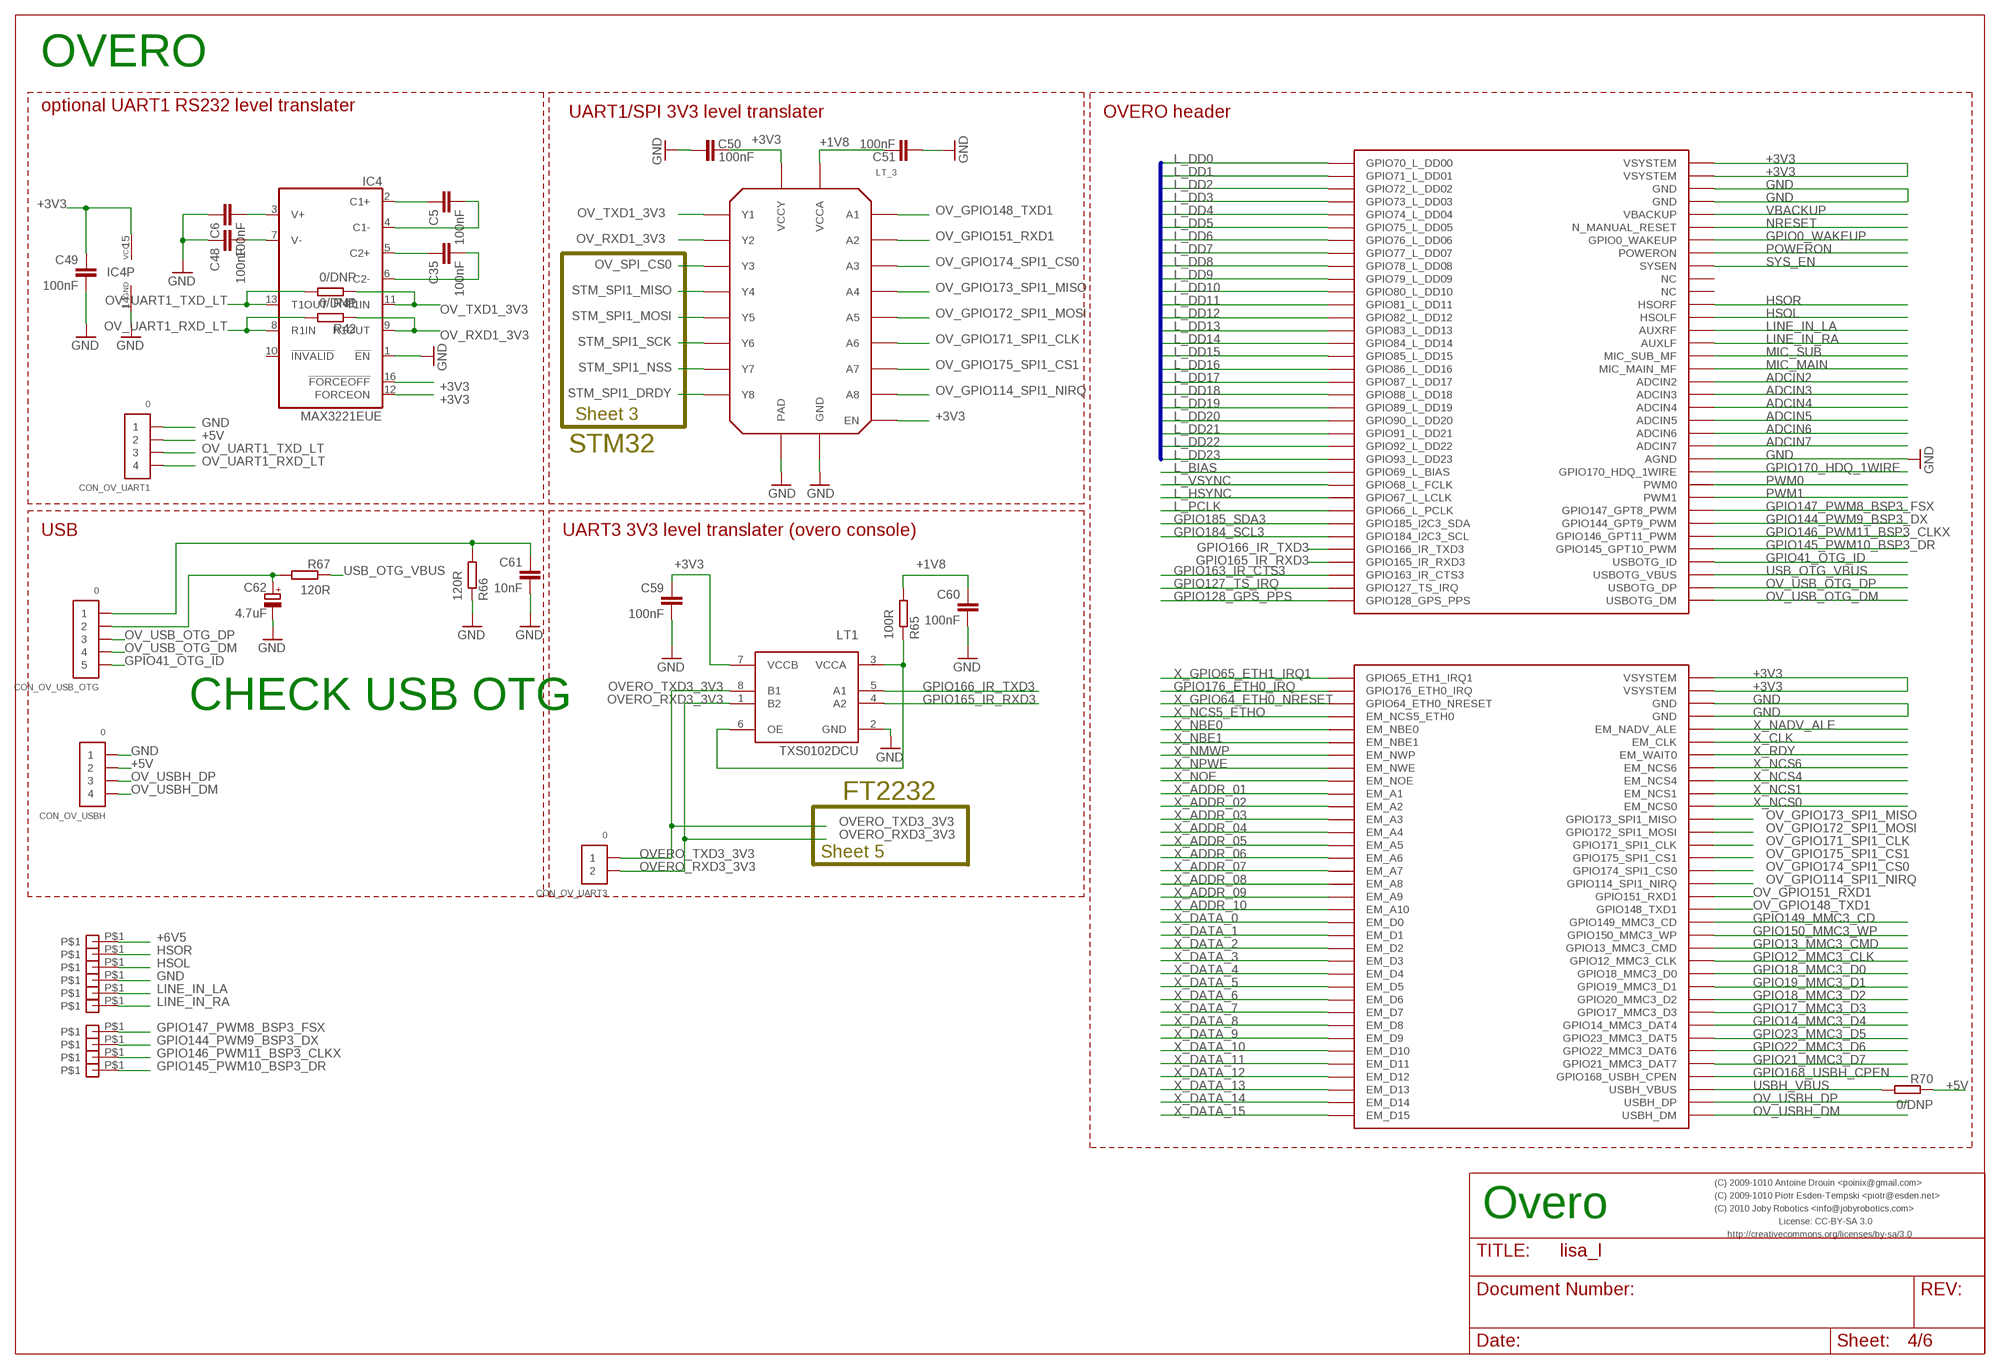
[diagram p3: schematic, sheet 4]

### Parts
C5  100nF  CAPACITOR-0603  [0603-CAP]
C6  100nF  CAPACITOR-0603  [0603-CAP]
C35  100nF  CAPACITOR-0603  [0603-CAP]
C48  100nF  CAPACITOR-0603  [0603-CAP]
C49  100nF  CAPACITOR-0603  [0603-CAP]
C50  100nF  CAPACITOR-0603  [0603-CAP]
C51  100nF  CAPACITOR-0603  [0603-CAP]
C59  100nF  CAPACITOR-0603  [0603-CAP]
C60  100nF  CAPACITOR-0603  [0603-CAP]
C61  10nF  CAPACITOR-0603  [0603-CAP]
C62  4.7uF  CAPACITOR-POL-0603  [0603-POL-CAP]
CON_OV_UART1  0  CONN_4-1-53261  [PB-53261-04]
CON_OV_UART3  0  CONN_2-1-53261  [PB-53261-02]
CON_OV_USB_OTG  0  CONN_5-1-53261  [PB-53261-05]
CON_OV_USBH  0  CONN_4-1-53261  [PB-53261-04]
IC4  MAX3221EUE  [TSSOP16]
J3&4  OVERO  [OVERO]
LT1  TXS0102DCU  [US8]
LT_3  AD3308BCPZ  [LFCSP-20]
R41  0/DNP  RESISTOR-0603  [0603-RES]
R42  0/DNP  RESISTOR-0603  [0603-RES]
R65  100R  RESISTOR-0603  [0603-RES]
R66  120R  RESISTOR-0603  [0603-RES]
R67  120R  RESISTOR-0603  [0603-RES]
R70  0/DNP  RESISTOR-0603  [0603-RES]
U$1  SOLDER_PAD  [SOLDER_PAD_SMALL]
U$2  SOLDER_PAD  [SOLDER_PAD_SMALL]
U$3  SOLDER_PAD  [SOLDER_PAD_SMALL]
U$4  SOLDER_PAD  [SOLDER_PAD_SMALL]
U$5  SOLDER_PAD  [SOLDER_PAD_SMALL]
U$6  SOLDER_PAD  [SOLDER_PAD_SMALL]
U$7  SOLDER_PAD  [SOLDER_PAD_SMALL]
U$8  SOLDER_PAD  [SOLDER_PAD_SMALL]
U$9  SOLDER_PAD  [SOLDER_PAD_SMALL]
U$10  SOLDER_PAD  [SOLDER_PAD_SMALL]

### Nets
+1V8 [supply]: C51.P$1 C60.P$1 LT_3.P$19(VCCA) R65.P$2 ; also sheet 2
+3V3: C49.P$1 C50.P$1 C59.P$1 IC4.12(FORCEON) IC4.15(VCC) IC4.16(!FORCEOFF) J3&4.VSYSTEM@1(VSYSTEM) J3&4.VSYSTEM@2(VSYSTEM) J3&4.VSYSTEM@66(VSYSTEM) J3&4.VSYSTEM@67(VSYSTEM) LT1.7(VCCB) LT_3.P$8(EN) LT_3.P$18(VCCY) ; also sheet 2,3
+5V: CON_OV_UART1.2 CON_OV_USBH.2 R70.P$1 ; also sheet 2,3
+6V5: U$1.P$1 ; also sheet 2,3
ADCIN2: J3&4.ADCIN2
ADCIN3: J3&4.ADCIN3
ADCIN4: J3&4.ADCIN4
ADCIN5: J3&4.ADCIN5
ADCIN6: J3&4.ADCIN6
ADCIN7: J3&4.ADCIN7
GND: C6.P$1 C48.P$1 C49.P$2 C50.P$2 C51.P$2 C59.P$2 C60.P$2 C61.P$2 C62.- CON_OV_UART1.1 CON_OV_USBH.1 IC4.1(!EN) IC4.14(GND) J3&4.AGND J3&4.GND J3&4.GND@33(GND) J3&4.GND@56(GND) J3&4.GND@70(GND) LT1.2(GND) LT_3.P$9(GND) LT_3.P$21(PAD) R66.P$1 U$4.P$1 ; also sheet 2,3,5
GPIO0_WAKEUP: J3&4.GPIO0_WAKEUP
GPIO12_MMC3_CLK: J3&4.GPIO12_MMC3_CLK
GPIO13_MMC3_CMD: J3&4.GPIO13_MMC3_CMD
GPIO14_MMC3_D4: J3&4.GPIO14_MMC3_DAT4
GPIO17_MMC3_D3: J3&4.GPIO17_MMC3_D3
GPIO18_MMC3_D0: J3&4.GPIO18_MMC3_D0
GPIO18_MMC3_D2: J3&4.GPIO20_MMC3_D2
GPIO19_MMC3_D1: J3&4.GPIO19_MMC3_D1
GPIO21_MMC3_D7: J3&4.GPIO21_MMC3_DAT7
GPIO22_MMC3_D6: J3&4.GPIO22_MMC3_DAT6
GPIO23_MMC3_D5: J3&4.GPIO23_MMC3_DAT5
GPIO41_OTG_ID: CON_OV_USB_OTG.5 J3&4.USBOTG_ID
GPIO127_TS_IRQ: J3&4.GPIO127_TS_IRQ
GPIO128_GPS_PPS: J3&4.GPIO128_GPS_PPS
GPIO144_PWM9_BSP3_DX: J3&4.GPIO144_GPT9_PWM U$8.P$1
GPIO145_PWM10_BSP3_DR: J3&4.GPIO145_GPT10_PWM U$10.P$1
GPIO146_PWM11_BSP3_CLKX: J3&4.GPIO146_GPT11_PWM U$9.P$1
GPIO147_PWM8_BSP3_FSX: J3&4.GPIO147_GPT8_PWM U$7.P$1
GPIO149_MMC3_CD: J3&4.GPIO149_MMC3_CD
GPIO150_MMC3_WP: J3&4.GPIO150_MMC3_WP
GPIO163_IR_CTS3: J3&4.GPIO163_IR_CTS3
GPIO165_IR_RXD3: J3&4.GPIO165_IR_RXD3 LT1.4(A2)
GPIO166_IR_TXD3: J3&4.GPIO166_IR_TXD3 LT1.5(A1)
GPIO168_USBH_CPEN: J3&4.GPIO168_USBH_CPEN
GPIO170_HDQ_1WIRE: J3&4.GPIO170_HDQ_1WIRE
GPIO176_ETH0_IRQ: J3&4.GPIO176_ETH0_IRQ
GPIO184_SCL3: J3&4.GPIO184_I2C3_SCL
GPIO185_SDA3: J3&4.GPIO185_I2C3_SDA
HSOL [analog]: J3&4.HSOLF U$3.P$1
HSOR [analog]: J3&4.HSORF U$2.P$1
L_BIAS: J3&4.GPIO69_L_BIAS
L_DD0: J3&4.GPIO70_L_DD00
L_DD1: J3&4.GPIO71_L_DD01
L_DD2: J3&4.GPIO72_L_DD02
L_DD3: J3&4.GPIO73_L_DD03
L_DD4: J3&4.GPIO74_L_DD04
L_DD5: J3&4.GPIO75_L_DD05
L_DD6: J3&4.GPIO76_L_DD06
L_DD7: J3&4.GPIO77_L_DD07
L_DD8: J3&4.GPIO78_L_DD08
L_DD9: J3&4.GPIO79_L_DD09
L_DD10: J3&4.GPIO80_L_DD10
L_DD11: J3&4.GPIO81_L_DD11
L_DD12: J3&4.GPIO82_L_DD12
L_DD13: J3&4.GPIO83_L_DD13
L_DD14: J3&4.GPIO84_L_DD14
L_DD15: J3&4.GPIO85_L_DD15
L_DD16: J3&4.GPIO86_L_DD16
L_DD17: J3&4.GPIO87_L_DD17
L_DD18: J3&4.GPIO88_L_DD18
L_DD19: J3&4.GPIO89_L_DD19
L_DD20: J3&4.GPIO90_L_DD20
L_DD21: J3&4.GPIO91_L_DD21
L_DD22: J3&4.GPIO92_L_DD22
L_DD23: J3&4.GPIO93_L_DD23
L_HSYNC: J3&4.GPIO67_L_LCLK
L_PCLK: J3&4.GPIO66_L_PCLK
L_VSYNC: J3&4.GPIO68_L_FCLK
LINE_IN_LA [analog]: J3&4.AUXRF U$5.P$1
LINE_IN_RA [analog]: J3&4.AUXLF U$6.P$1
MIC_MAIN: J3&4.MIC_MAIN_MF
MIC_SUB: J3&4.MIC_SUB_MF
N$41: C5.P$1 IC4.2(C1+)
N$42: C5.P$2 IC4.4(C1-)
N$43: C35.P$1 IC4.5(C2+)
N$44: C35.P$2 IC4.6(C2-)
N$45: C6.P$2 IC4.3(V+)
N$46: C48.P$2 IC4.7(V-)
N$111: C61.P$1 CON_OV_USB_OTG.1 R66.P$2
N$112: C62.+ CON_OV_USB_OTG.2 R67.P$2
N$123: LT1.3(VCCA) LT1.6(OE) R65.P$1
NRESET: J3&4.N_MANUAL_RESET
OV_GPIO114_SPI1_NIRQ: J3&4.GPIO114_SPI1_NIRQ LT_3.P$7(A8)
OV_GPIO148_TXD1: J3&4.GPIO148_TXD1 LT_3.P$20(A1)
OV_GPIO151_RXD1: J3&4.GPIO151_RXD1 LT_3.P$1(A2)
OV_GPIO171_SPI1_CLK: J3&4.GPIO171_SPI1_CLK LT_3.P$5(A6)
OV_GPIO172_SPI1_MOSI: J3&4.GPIO172_SPI1_MOSI LT_3.P$4(A5)
OV_GPIO173_SPI1_MISO: J3&4.GPIO173_SPI1_MISO LT_3.P$3(A4)
OV_GPIO174_SPI1_CS0: J3&4.GPIO174_SPI1_CS0 LT_3.P$2(A3)
OV_GPIO175_SPI1_CS1: J3&4.GPIO175_SPI1_CS1 LT_3.P$6(A7)
OV_RXD1_3V3: IC4.9(R1OUT) LT_3.P$16(Y2) R42.P$1
OV_SPI_CS0: LT_3.P$15(Y3) ; also sheet 3
OV_TXD1_3V3: IC4.11(T1IN) LT_3.P$17(Y1) R41.P$1
OV_UART1_RXD_LT: CON_OV_UART1.4 IC4.8(R1IN) R42.P$2
OV_UART1_TXD_LT: CON_OV_UART1.3 IC4.13(T1OUT) R41.P$2
OV_USB_OTG_DM [USB]: CON_OV_USB_OTG.4 J3&4.USBOTG_DM
OV_USB_OTG_DP [USB]: CON_OV_USB_OTG.3 J3&4.USBOTG_DP
OV_USBH_DM [USB]: CON_OV_USBH.4 J3&4.USBH_DM
OV_USBH_DP [USB]: CON_OV_USBH.3 J3&4.USBH_DP
OVERO_RXD3_3V3: CON_OV_UART3.2 LT1.1(B2) ; also sheet 5
OVERO_TXD3_3V3: CON_OV_UART3.1 LT1.8(B1) ; also sheet 5
POWERON: J3&4.POWERON
PWM0: J3&4.PWM0
PWM1: J3&4.PWM1
STM_SPI1_DRDY: LT_3.P$10(Y8) ; also sheet 3
STM_SPI1_MISO: LT_3.P$14(Y4) ; also sheet 3
STM_SPI1_MOSI: LT_3.P$13(Y5) ; also sheet 3
STM_SPI1_NSS: LT_3.P$11(Y7) ; also sheet 3
STM_SPI1_SCK: LT_3.P$12(Y6) ; also sheet 3
SYS_EN: J3&4.SYSEN ; also sheet 2
USB_OTG_VBUS [xxwide]: J3&4.USBOTG_VBUS R67.P$1
USBH_VBUS [xxwide]: J3&4.USBH_VBUS R70.P$2
VBACKUP: J3&4.VBACKUP
X_ADDR_01: J3&4.EM_A1
X_ADDR_02: J3&4.EM_A2
X_ADDR_03: J3&4.EM_A3
X_ADDR_04: J3&4.EM_A4
X_ADDR_05: J3&4.EM_A5
X_ADDR_06: J3&4.EM_A6
X_ADDR_07: J3&4.EM_A7
X_ADDR_08: J3&4.EM_A8
X_ADDR_09: J3&4.EM_A9
X_ADDR_10: J3&4.EM_A10
X_CLK: J3&4.EM_CLK
X_DATA_0: J3&4.EM_D0
X_DATA_1: J3&4.EM_D1
X_DATA_2: J3&4.EM_D2
X_DATA_3: J3&4.EM_D3
X_DATA_4: J3&4.EM_D4
X_DATA_5: J3&4.EM_D5
X_DATA_6: J3&4.EM_D6
X_DATA_7: J3&4.EM_D7
X_DATA_8: J3&4.EM_D8
X_DATA_9: J3&4.EM_D9
X_DATA_10: J3&4.EM_D10
X_DATA_11: J3&4.EM_D11
X_DATA_12: J3&4.EM_D12
X_DATA_13: J3&4.EM_D13
X_DATA_14: J3&4.EM_D14
X_DATA_15: J3&4.EM_D15
X_GPIO64_ETH0_NRESET: J3&4.GPIO64_ETH0_NRESET
X_GPIO65_ETH1_IRQ1: J3&4.GPIO65_ETH1_IRQ1
X_NADV_ALE: J3&4.EM_NADV_ALE
X_NBE0: J3&4.EM_NBE0
X_NBE1: J3&4.EM_NBE1
X_NCS0: J3&4.EM_NCS0
X_NCS1: J3&4.EM_NCS1
X_NCS4: J3&4.EM_NCS4
X_NCS5_ETHO: J3&4.EM_NCS5_ETH0
X_NCS6: J3&4.EM_NCS6
X_NMWP: J3&4.EM_NWP
X_NOE: J3&4.EM_NOE
X_NPWE: J3&4.EM_NWE
X_RDY: J3&4.EM_WAIT0
Unconnected: IC4.10(!INVALID) J3&4.NC@62(NC) J3&4.NC@63(NC)

### Buses
L_DD[0..23]

### Notes on the sheet
- OVERO
- optional UART1 RS232 level translater
- UART1/SPI 3V3 level translater | OVERO header
- Sheet 3
- STM32
- USB | UART3 3V3 level translater (overo console)
- CHECK USB OTG
- FT2232
- Sheet 5
- (C) 2009-1010 Antoine Drouin <poinix@gmail.com>
- (C) 2009-1010 Piotr Esden-Tempski <piotr@esden.net>
- (C) 2010 Joby Robotics <info@jobyrobotics.com>
- Overo
- License: CC-BY-SA 3.0
- http://creativecommons.org/licenses/by-sa/3.0

## Sheet 5 of 6
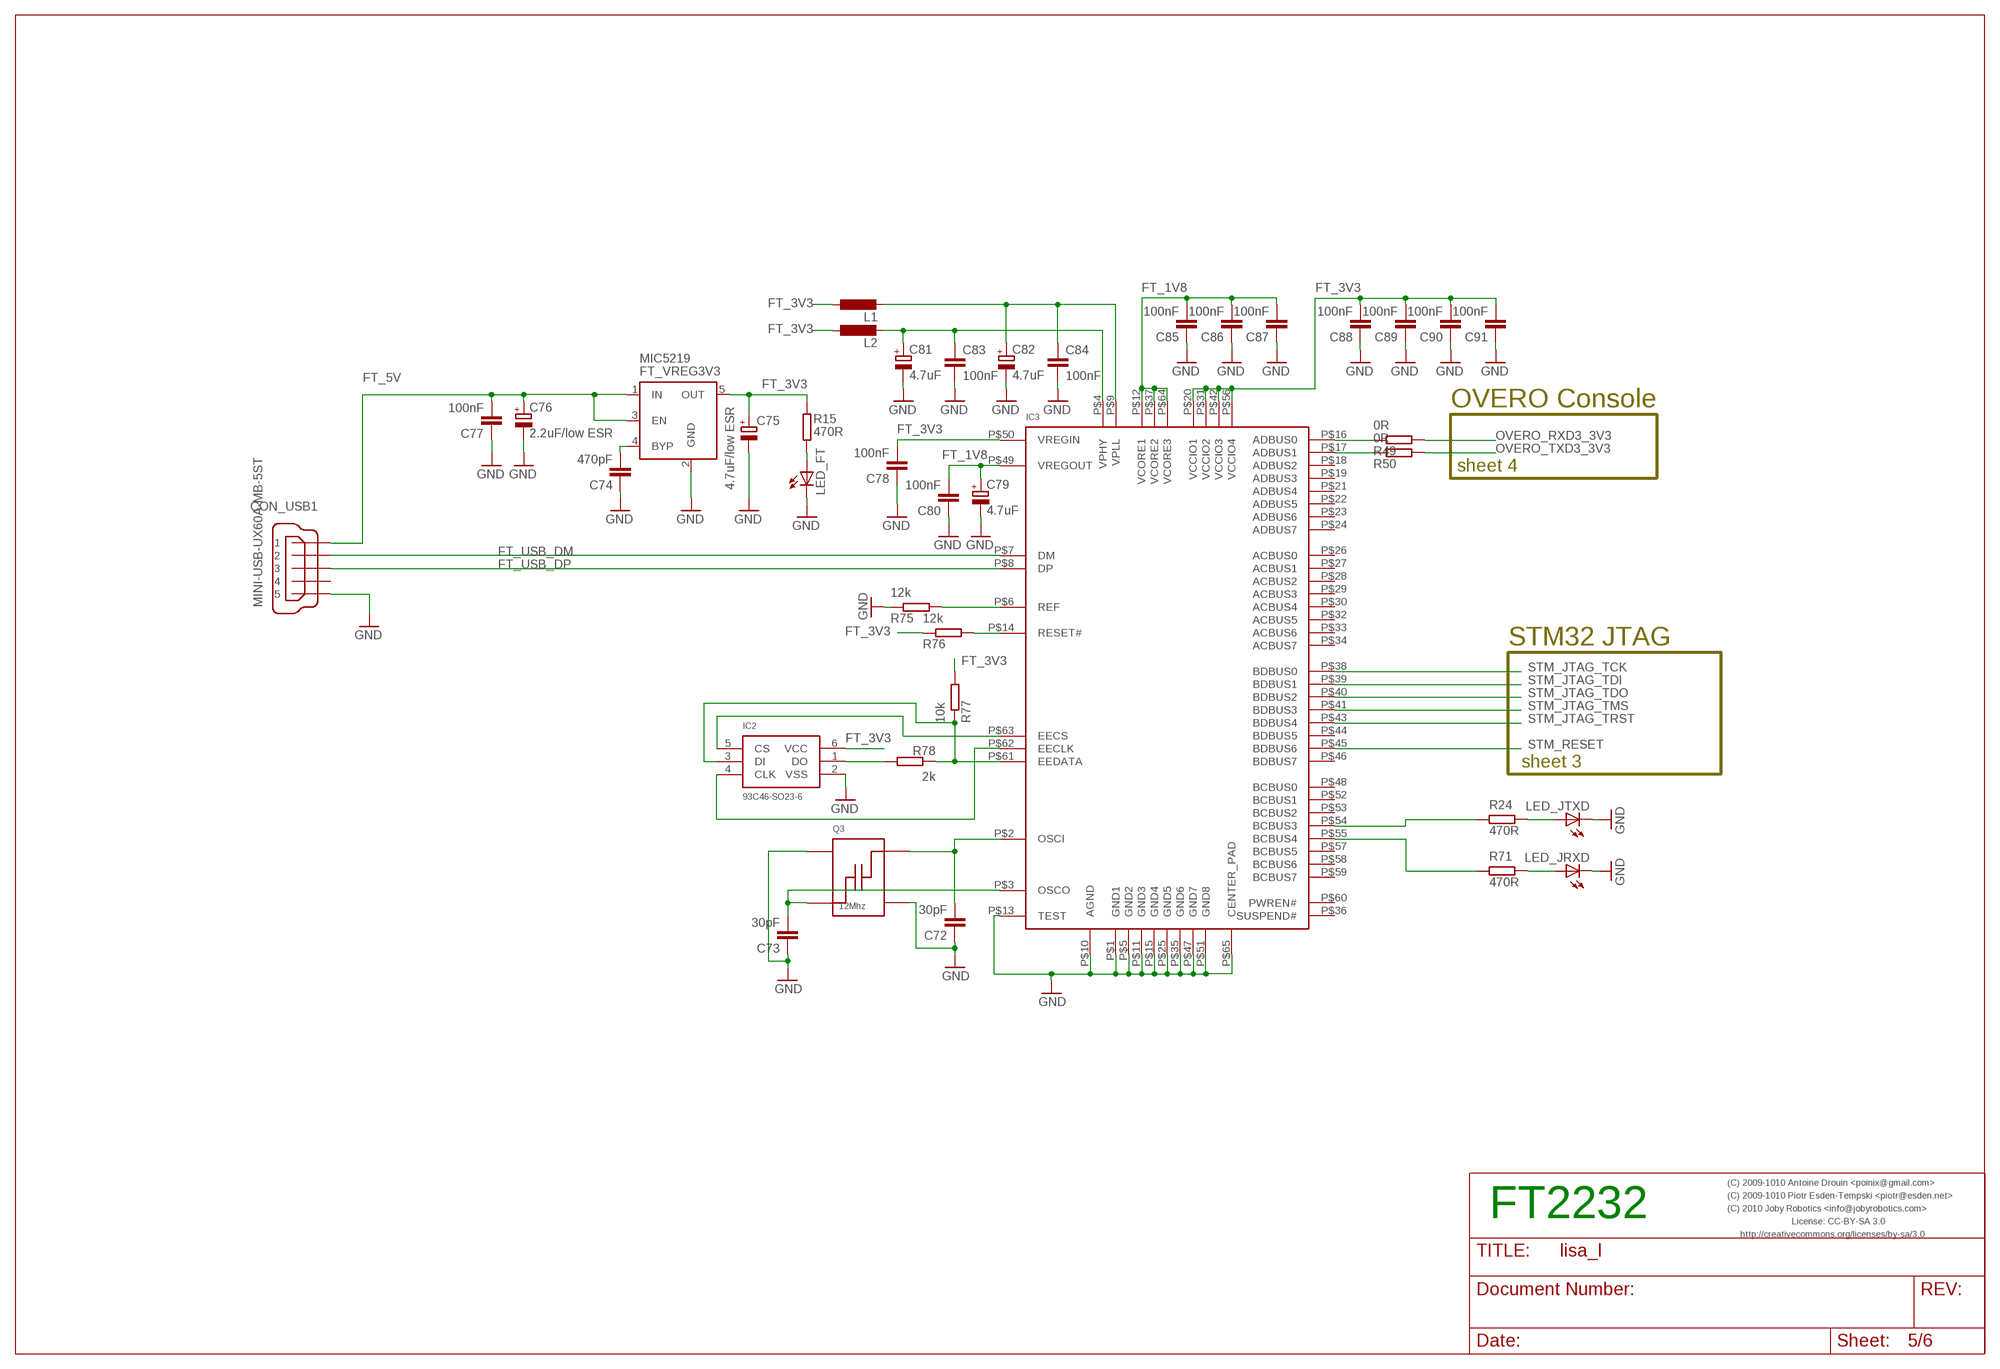
[diagram p4: schematic, sheet 5]

### Parts
C72  30pF  CAPACITOR-0603  [0603-CAP]
C73  30pF  CAPACITOR-0603  [0603-CAP]
C74  470pF  CAPACITOR-0603  [0603-CAP]
C75  4.7uF/low ESR  CAPACITOR-POL-0603  [0603-POL-CAP]
C76  2.2uF/low ESR  CAPACITOR-POL-0603  [0603-POL-CAP]
C77  100nF  CAPACITOR-0603  [0603-CAP]
C78  100nF  CAPACITOR-0603  [0603-CAP]
C79  4.7uF  CAPACITOR-POL-0603  [0603-POL-CAP]
C80  100nF  CAPACITOR-0603  [0603-CAP]
C81  4.7uF  CAPACITOR-POL-0603  [0603-POL-CAP]
C82  4.7uF  CAPACITOR-POL-0603  [0603-POL-CAP]
C83  100nF  CAPACITOR-0603  [0603-CAP]
C84  100nF  CAPACITOR-0603  [0603-CAP]
C85  100nF  CAPACITOR-0603  [0603-CAP]
C86  100nF  CAPACITOR-0603  [0603-CAP]
C87  100nF  CAPACITOR-0603  [0603-CAP]
C88  100nF  CAPACITOR-0603  [0603-CAP]
C89  100nF  CAPACITOR-0603  [0603-CAP]
C90  100nF  CAPACITOR-0603  [0603-CAP]
C91  100nF  CAPACITOR-0603  [0603-CAP]
CON_USB1  MINI-USB-UX60A-MB-5ST  [UX60A-MB-5ST]
FT_VREG3V3  MIC5219  MIC5219XX  [SOT23-5]
IC2  93C46-SO23-6  [SO23-6]
IC3  FT2232HQ  [QFN64]
L1  INDUCTOR-0603  [0603-IND]
L2  INDUCTOR-0603  [0603-IND]
LED_FT  LED-0603  [0603-LED]
LED_JRXD  LED-0603  [0603-LED]
LED_JTXD  LED-0603  [0603-LED]
Q3  12Mhz  ABM8  [ABM8]
R15  470R  RESISTOR-0603  [0603-RES]
R24  470R  RESISTOR-0603  [0603-RES]
R49  0R  RESISTOR-0603  [0603-RES]
R50  0R  RESISTOR-0603  [0603-RES]
R71  470R  RESISTOR-0603  [0603-RES]
R75  12k  RESISTOR-0603  [0603-RES]
R76  12k  RESISTOR-0603  [0603-RES]
R77  10k  RESISTOR-0603  [0603-RES]
R78  2k  RESISTOR-0603  [0603-RES]

### Nets
FT_1V8: C79.+ C80.P$2 C85.P$2 C86.P$2 C87.P$2 IC3.P$12(VCORE1) IC3.P$37(VCORE2) IC3.P$49(VREGOUT) IC3.P$64(VCORE3)
FT_3V3: C75.+ C78.P$2 C88.P$2 C89.P$2 C90.P$2 C91.P$2 FT_VREG3V3.5(OUT) IC2.6(VCC) IC3.P$20(VCCIO1) IC3.P$31(VCCIO2) IC3.P$42(VCCIO3) IC3.P$50(VREGIN) IC3.P$56(VCCIO4) L1.P$1 L2.P$1 R15.P$2 R76.P$1 R77.P$2
FT_5V: C76.+ C77.P$2 CON_USB1.1 FT_VREG3V3.1(IN) FT_VREG3V3.3(EN)
FT_USB_DM: CON_USB1.2 IC3.P$7(DM)
FT_USB_DP: CON_USB1.3 IC3.P$8(DP)
GND: C72.P$1 C73.P$1 C74.P$1 C75.- C76.- C77.P$1 C78.P$1 C79.- C80.P$1 C81.- C82.- C83.P$2 C84.P$2 C85.P$1 C86.P$1 C87.P$1 C88.P$1 C89.P$1 C90.P$1 C91.P$1 CON_USB1.5 FT_VREG3V3.2(GND) IC2.2(VSS) IC3.P$1(GND1) IC3.P$5(GND2) IC3.P$10(AGND) IC3.P$11(GND3) IC3.P$13(TEST) IC3.P$15(GND4) IC3.P$25(GND5) IC3.P$35(GND6) IC3.P$47(GND7) IC3.P$51(GND8) IC3.P$65(CENTER_PAD) LED_FT.C LED_JRXD.C LED_JTXD.C Q3.P$2 Q3.P$4 R75.P$1 ; also sheet 2,3,4
N$4: LED_JTXD.A R24.P$1
N$6: IC3.P$16(ADBUS0) R49.P$1
N$7: IC3.P$54(BCBUS3) R24.P$2
N$12: LED_JRXD.A R71.P$1
N$13: IC3.P$55(BCBUS4) R71.P$2
N$16: LED_FT.A R15.P$1
N$18: IC3.P$17(ADBUS1) R50.P$1
N$34: C72.P$2 IC3.P$2(OSCI) Q3.P$3
N$35: C73.P$2 IC3.P$3(OSCO) Q3.P$1
N$39: IC3.P$6(REF) R75.P$2
N$40: IC3.P$14(RESET#) R76.P$2
N$47: C74.P$2 FT_VREG3V3.4(BYP)
N$48: C81.+ C83.P$1 IC3.P$4(VPHY) L2.P$2
N$49: C82.+ C84.P$1 IC3.P$9(VPLL) L1.P$2
N$50: IC2.4(CLK) IC3.P$62(EECLK)
N$51: IC2.5(CS) IC3.P$63(EECS)
N$53: IC2.3(DI) IC3.P$61(EEDATA) R77.P$1 R78.P$1
N$54: IC2.1(DO) R78.P$2
OVERO_RXD3_3V3: R49.P$2 ; also sheet 4
OVERO_TXD3_3V3: R50.P$2 ; also sheet 4
STM_JTAG_TCK: IC3.P$38(BDBUS0) ; also sheet 3
STM_JTAG_TDI: IC3.P$39(BDBUS1) ; also sheet 3
STM_JTAG_TDO: IC3.P$40(BDBUS2) ; also sheet 3
STM_JTAG_TMS: IC3.P$41(BDBUS3) ; also sheet 3
STM_JTAG_TRST: IC3.P$43(BDBUS4) ; also sheet 3
STM_RESET: IC3.P$45(BDBUS6) ; also sheet 3
Unconnected: CON_USB1.4 IC3.P$18(ADBUS2) IC3.P$19(ADBUS3) IC3.P$21(ADBUS4) IC3.P$22(ADBUS5) IC3.P$23(ADBUS6) IC3.P$24(ADBUS7) IC3.P$26(ACBUS0) IC3.P$27(ACBUS1) IC3.P$28(ACBUS2) IC3.P$29(ACBUS3) IC3.P$30(ACBUS4) IC3.P$32(ACBUS5) IC3.P$33(ACBUS6) IC3.P$34(ACBUS7) IC3.P$36(SUSPEND#) IC3.P$44(BDBUS5) IC3.P$46(BDBUS7) IC3.P$48(BCBUS0) IC3.P$52(BCBUS1) IC3.P$53(BCBUS2) IC3.P$57(BCBUS5) IC3.P$58(BCBUS6) IC3.P$59(BCBUS7) IC3.P$60(PWREN#)

### Notes on the sheet
- OVERO Console
- sheet 4
- STM32 JTAG
- sheet 3
- (C) 2009-1010 Antoine Drouin <poinix@gmail.com>
- (C) 2009-1010 Piotr Esden-Tempski <piotr@esden.net>
- (C) 2010 Joby Robotics <info@jobyrobotics.com>
- FT2232
- License: CC-BY-SA 3.0
- http://creativecommons.org/licenses/by-sa/3.0

## Sheet 6 of 6
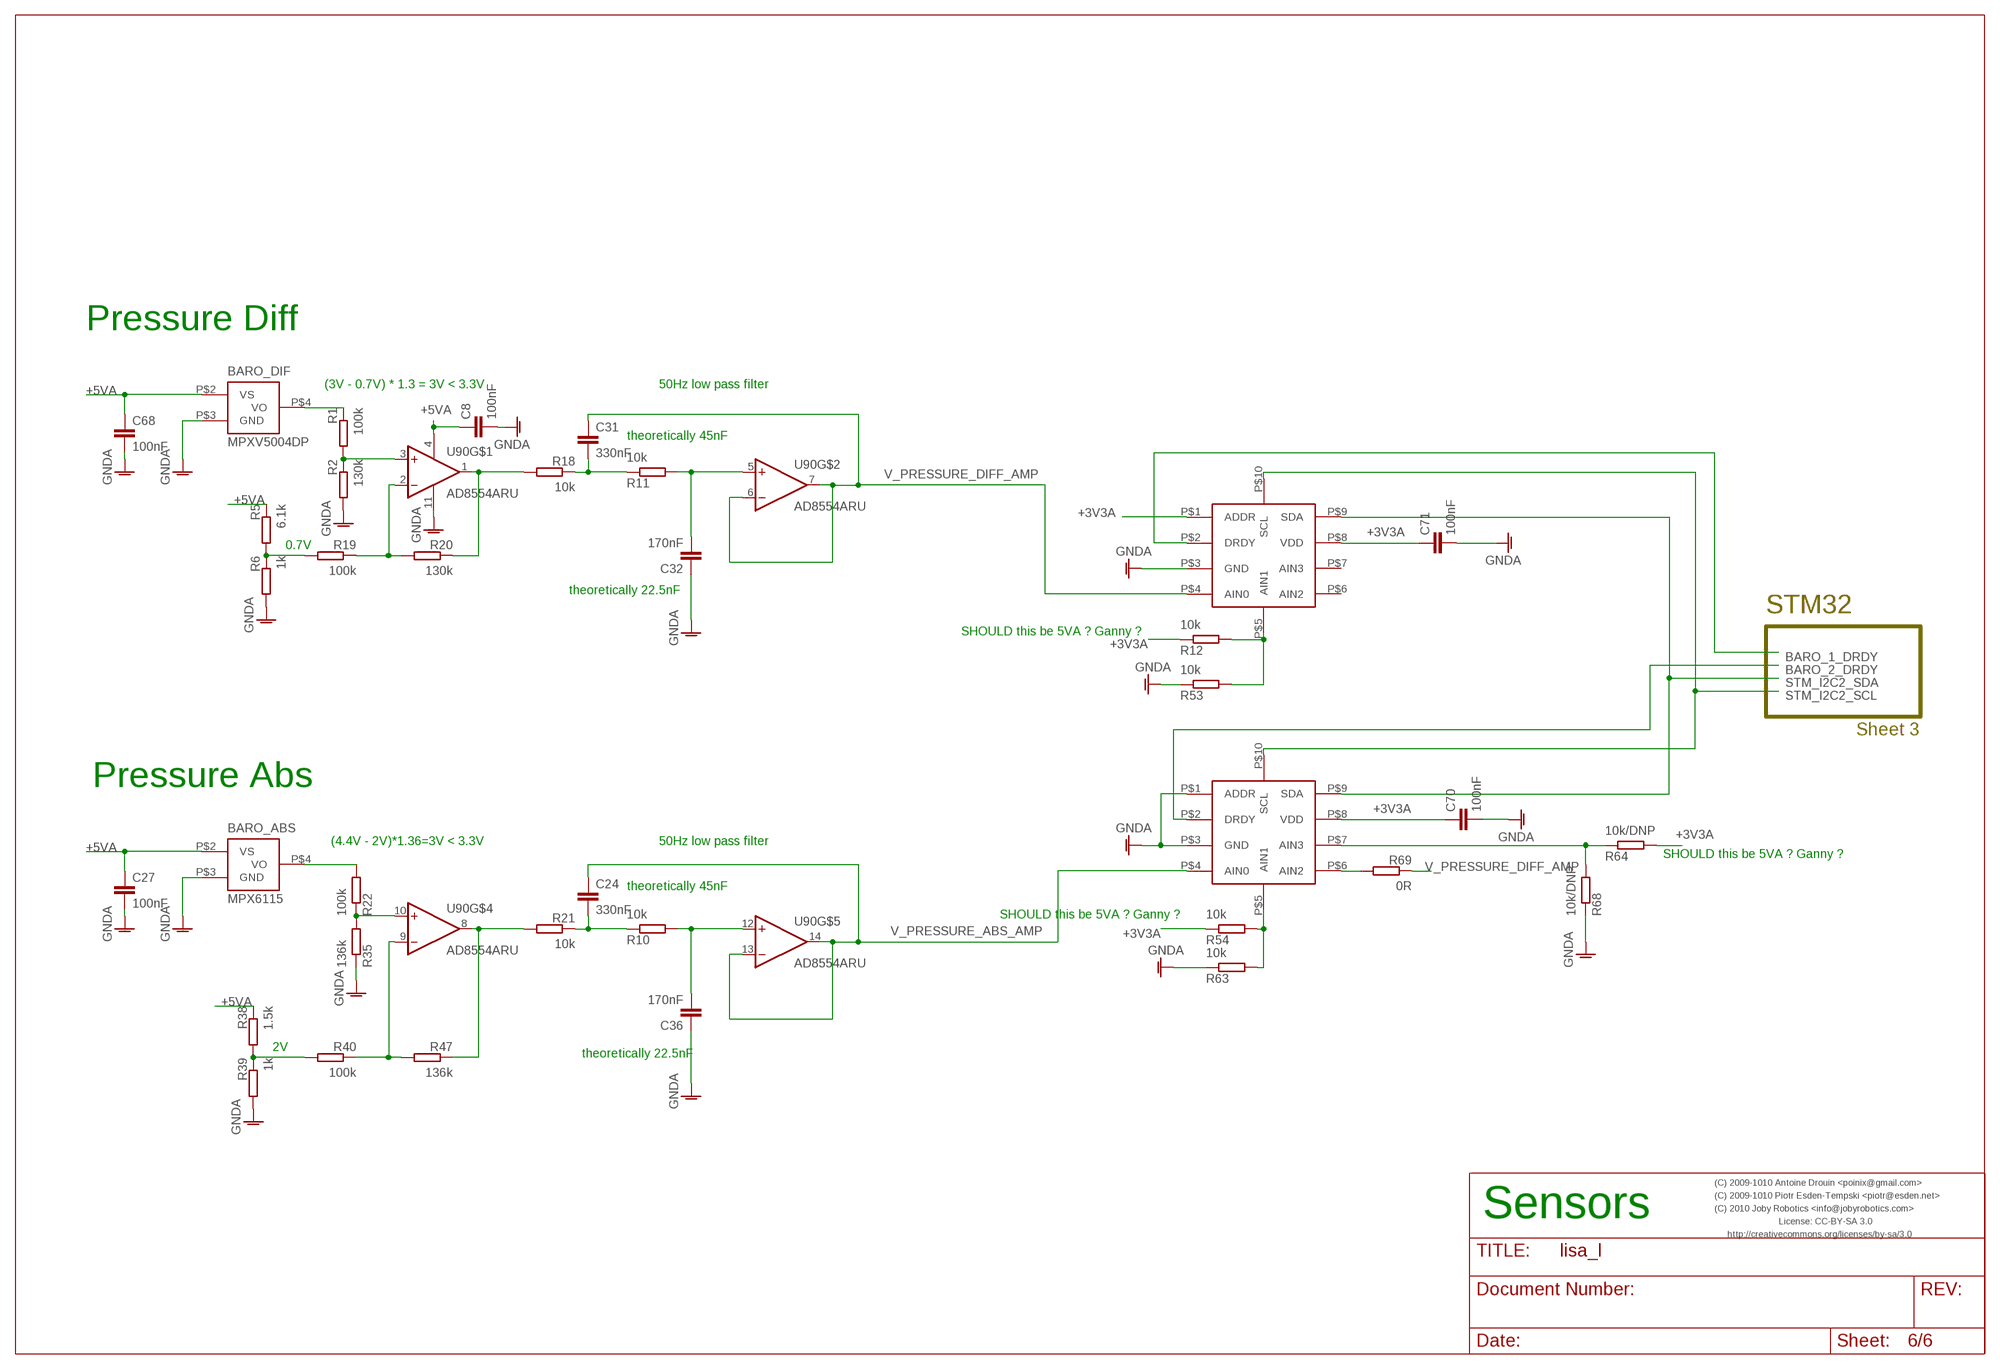
[diagram p5: schematic, sheet 6]

### Parts
ADC1  ADS1114  [R-PQFP-N10]
ADC2  ADS1114  [R-PQFP-N10]
BARO_ABS  MPX6115  [CASE_1317]
BARO_DIF  MPXV5004DP  [CASE1351]
C8  100nF  CAPACITOR-0603  [0603-CAP]
C24  330nF  CAPACITOR-0603  [0603-CAP]
C27  100nF  CAPACITOR-0603  [0603-CAP]
C31  330nF  CAPACITOR-0603  [0603-CAP]
C32  170nF  CAPACITOR-0603  [0603-CAP]
C36  170nF  CAPACITOR-0603  [0603-CAP]
C68  100nF  CAPACITOR-0603  [0603-CAP]
C70  100nF  CAPACITOR-0603  [0603-CAP]
C71  100nF  CAPACITOR-0603  [0603-CAP]
R1  100k  RESISTOR-0603  [0603-RES]
R2  130k  RESISTOR-0603  [0603-RES]
R5  6.1k  RESISTOR-0603  [0603-RES]
R6  1k  RESISTOR-0603  [0603-RES]
R10  10k  RESISTOR-0603  [0603-RES]
R11  10k  RESISTOR-0603  [0603-RES]
R12  10k  RESISTOR-0603  [0603-RES]
R18  10k  RESISTOR-0603  [0603-RES]
R19  100k  RESISTOR-0603  [0603-RES]
R20  130k  RESISTOR-0603  [0603-RES]
R21  10k  RESISTOR-0603  [0603-RES]
R22  100k  RESISTOR-0603  [0603-RES]
R35  136k  RESISTOR-0603  [0603-RES]
R38  1.5k  RESISTOR-0603  [0603-RES]
R39  1k  RESISTOR-0603  [0603-RES]
R40  100k  RESISTOR-0603  [0603-RES]
R47  136k  RESISTOR-0603  [0603-RES]
R53  10k  RESISTOR-0603  [0603-RES]
R54  10k  RESISTOR-0603  [0603-RES]
R63  10k  RESISTOR-0603  [0603-RES]
R64  10k/DNP  RESISTOR-0603  [0603-RES]
R68  10k/DNP  RESISTOR-0603  [0603-RES]
R69  0R  RESISTOR-0603  [0603-RES]
U90  AD8554ARU  [TSSOP14]

### Nets
+3V3A: ADC1.P$1(ADDR) ADC1.P$8(VDD) ADC2.P$8(VDD) C70.P$1 C71.P$1 R12.P$1 R54.P$1 R64.P$2 ; also sheet 2
+5VA: BARO_ABS.P$2(VS) BARO_DIF.P$2(VS) C8.P$1 C27.P$1 C68.P$1 R5.P$1 R38.P$1 U90.4(V+) ; also sheet 2
BARO_1_DRDY: ADC1.P$2(DRDY) ; also sheet 3
BARO_2_DRDY: ADC2.P$2(DRDY) ; also sheet 3
GNDA: ADC1.P$3(GND) ADC2.P$1(ADDR) ADC2.P$3(GND) BARO_ABS.P$3(GND) BARO_DIF.P$3(GND) C8.P$2 C27.P$2 C32.P$1 C36.P$1 C68.P$2 C70.P$2 C71.P$2 R2.P$2 R6.P$2 R35.P$1 R39.P$2 R53.P$1 R63.P$1 R68.P$1 U90.11(V-) ; also sheet 2
N$8: ADC1.P$5(AIN1) R12.P$2 R53.P$2
N$9: C36.P$2 R10.P$2 U90.12(+IN)
N$15: ADC2.P$5(AIN1) R54.P$2 R63.P$2
N$21: BARO_ABS.P$4(VO) R22.P$2
N$28: R1.P$2 R2.P$1 U90.3(+IN)
N$31: BARO_DIF.P$4(VO) R1.P$1
N$55: ADC2.P$6(AIN2) R69.P$2
N$56: ADC2.P$7(AIN3) R64.P$1 R68.P$2
N$66: C32.P$2 R11.P$2 U90.5(+IN)
N$67: R5.P$2 R6.P$1 R19.P$2
N$68: C31.P$2 R11.P$1 R18.P$1
N$69: R18.P$2 R20.P$1 U90.1(OUT)
N$70: R19.P$1 R20.P$2 U90.2(-IN)
N$71: R22.P$1 R35.P$2 U90.10(+IN)
N$72: R21.P$2 R47.P$1 U90.8(OUT)
N$73: C24.P$2 R10.P$1 R21.P$1
N$74: R38.P$2 R39.P$1 R40.P$2
N$76: R40.P$1 R47.P$2 U90.9(-IN)
STM_I2C2_SCL: ADC1.P$10(SCL) ADC2.P$10(SCL) ; also sheet 3
STM_I2C2_SDA: ADC1.P$9(SDA) ADC2.P$9(SDA) ; also sheet 3
V_PRESSURE_ABS_AMP: ADC2.P$4(AIN0) C24.P$1 U90.13(-IN) U90.14(OUT)
V_PRESSURE_DIFF_AMP: ADC1.P$4(AIN0) C31.P$1 R69.P$1 U90.6(-IN) U90.7(OUT)
Unconnected: ADC1.P$6(AIN2) ADC1.P$7(AIN3)

### Notes on the sheet
- Pressure Diff
- (3V - 0.7V) * 1.3 = 3V < 3.3V | 50Hz low pass filter
- theoretically 45nF
- 0.7V
- theoretically 22.5nF
- STM32
- SHOULD this be 5VA ? Ganny ?
- Sheet 3
- Pressure Abs
- (4.4V - 2V)*1.36=3V < 3.3V | 50Hz low pass filter
- SHOULD this be 5VA ? Ganny ?
- theoretically 45nF
- SHOULD this be 5VA ? Ganny ?
- 2V
- theoretically 22.5nF
- (C) 2009-1010 Antoine Drouin <poinix@gmail.com>
- (C) 2009-1010 Piotr Esden-Tempski <piotr@esden.net>
- (C) 2010 Joby Robotics <info@jobyrobotics.com>
- Sensors
- License: CC-BY-SA 3.0
- http://creativecommons.org/licenses/by-sa/3.0

## Power pins joined to a net without a drawn wire
VREF: U1.5(VREF)

## Library data of the parts
ADC1 ADC2 = booz:ADS1114: 16 bit ADC
BARO_ABS = booz:MPX6115
BARO_DIF = booz:MPXV5004DP
BAT_IN BAT_IN1 GND_IN GND_IN1 = paparazzi:SOLDER_PAD
C1 C3 C15-C18 C22 C26 C38 C40 C44 C52 C57 C62 C75 C76 C79 C81 C82 = pel_dipol_comp:CAPACITOR-POL
C2 C4-C8 C10-C14 C19-C21 C23-C25 C27-C36 C41-C43 C45 C48-C51 C56 C59-C61 C63-C71 = pel_dipol_comp:CAPACITOR
C9 C37 C39 C72-C74 C77 C78 C80 C83-C91 = res_cap:CAPACITOR
C46 = pel_dipol_comp:CAPACITOR-POL; DM: 0; DR: 90.000; DX: 43.000; DY: 18.800; SHEETNO: 5
C47 = pel_dipol_comp:CAPACITOR-POL; DM: 0; DR: 90.000; DX: 49.400; DY: 19.200; SHEETNO: 5
CON_I2C2 CON_LIGHTS CON_USART1 = pel_molex:CONN_6-1
CON_I2C_IMU CON_OV_UART1 CON_OV_USBH = pel_molex:CONN_4-1
CON_MC1 CON_MC2 CON_OV_SPI CON_SPARE = pel_molex:CONN_8-1
CON_OV_UART3 = pel_molex:CONN_2-1
CON_OV_USB_OTG CON_USART2 CON_USART3 = pel_molex:CONN_5-1
CON_SERVOS_1 CON_SERVOS_2 = pel_molex:CONN_9-1
CON_SPI_IMU = molex:CONN_12-1
CON_USB1 = con-hirose:MINI-USB-: MINI USB Connector Source: http://www.hirose.co.jp/cataloge_hp/e24000019.pdf
FT_VREG3V3 = v-reg-micrel:MIC5219XX: VOLTAGE REGULATOR
IC1 = booz:STP08CP05
IC2 = misc:93C46: Microchip: 93AA46A/B/C, 93LC46A/B/C, 93C46A/B/C
IC3 = booz:FT2232HQ: Dual High Speed USB to multipurpose UART/FIFO
IC4 IC6 = maxim:MAX3221*: RS-232 Transceivers with AutoShutdown 1µA Supply-Current, True +3V to +5.5V http://dbserv.maxim-ic.com/
J3&4 = qualified_1:OVERO; DM: 0; DR: 0.000; DX: 33.400; DY: 8.800; SHEETNO: 3
JL1 JL2 = aspirin:JOBY_LOGO
L1-L3 = res_cap:INDUCTOR
LED_1-LED_4 = paparazzi:LED_DUO
LED_FT LED_JRXD LED_JTXD = res_cap:LED
LT1 = booz:TXS0102: 2-Bit Bidirectional Voltage-Level Translator for Open-Drain Application
LT_3 = booz:AD3308BCPZ: bidirectional level translator 8 channels
LT_I2C1 LT_I2C2 = booz:PCA9306: Dual bidirectional I2C-bus and SMBus voltage-level translator
MCU = pel_stm32:STM32-M-64: STM32F103 Medium Density 64pin LQFP
PWS1 PWS2 = paparazzi:TPS2051B
Q3 = booz:ABM8
Q7 = open-bldc:ASE_ASCILLATOR
R1 R2 R5-R7 R10-R13 R16-R21 R23 R25-R34 R36-R70 R72-R74 R79-R81 = pel_dipol_comp:RESISTOR
R3 R4 R14 R15 R22 R24 R35 R71 R75-R78 = res_cap:RESISTOR
REG3V3A REG5VA = v-reg-micrel:MIC5219BM5: VOLTAGE REGULATOR
REG6V5A = v-reg:LM317?*: 500 mA Adjustable Output Positive Voltage Regulator Source: http://www.onsemi.co.jp .. LM317M-D.PDF
REG_1V8 = qualified_1:MIC5219; DM: 0; DR: 90.000; DX: 46.400; DY: 19.200; SHEETNO: 5
REG_3V3D REG_5VD = paparazzi:PTH
U1 = microchip_can:MCP2551: High Speed CAN tranceiver
U90 = paparazzi:AD8554: quad opamp
U$1-U$10 = poinix:SOLDER_PAD
~NUDEV~1 = supply1:GND-GNDA: Example of GND--GNDA NET-Connetor for more info see description in package

## Net classes
0 default: width 0.152 mm, drill 0.305 mm, clearance 0.152 mm
1 supply: width 0.203 mm
4 xxwide: width 0.203 mm
5 USB: width 0.191 mm